# EAGLE design OpenModemV2_rx (EAGLE 9.6.0)

## Sheet 1 of 2
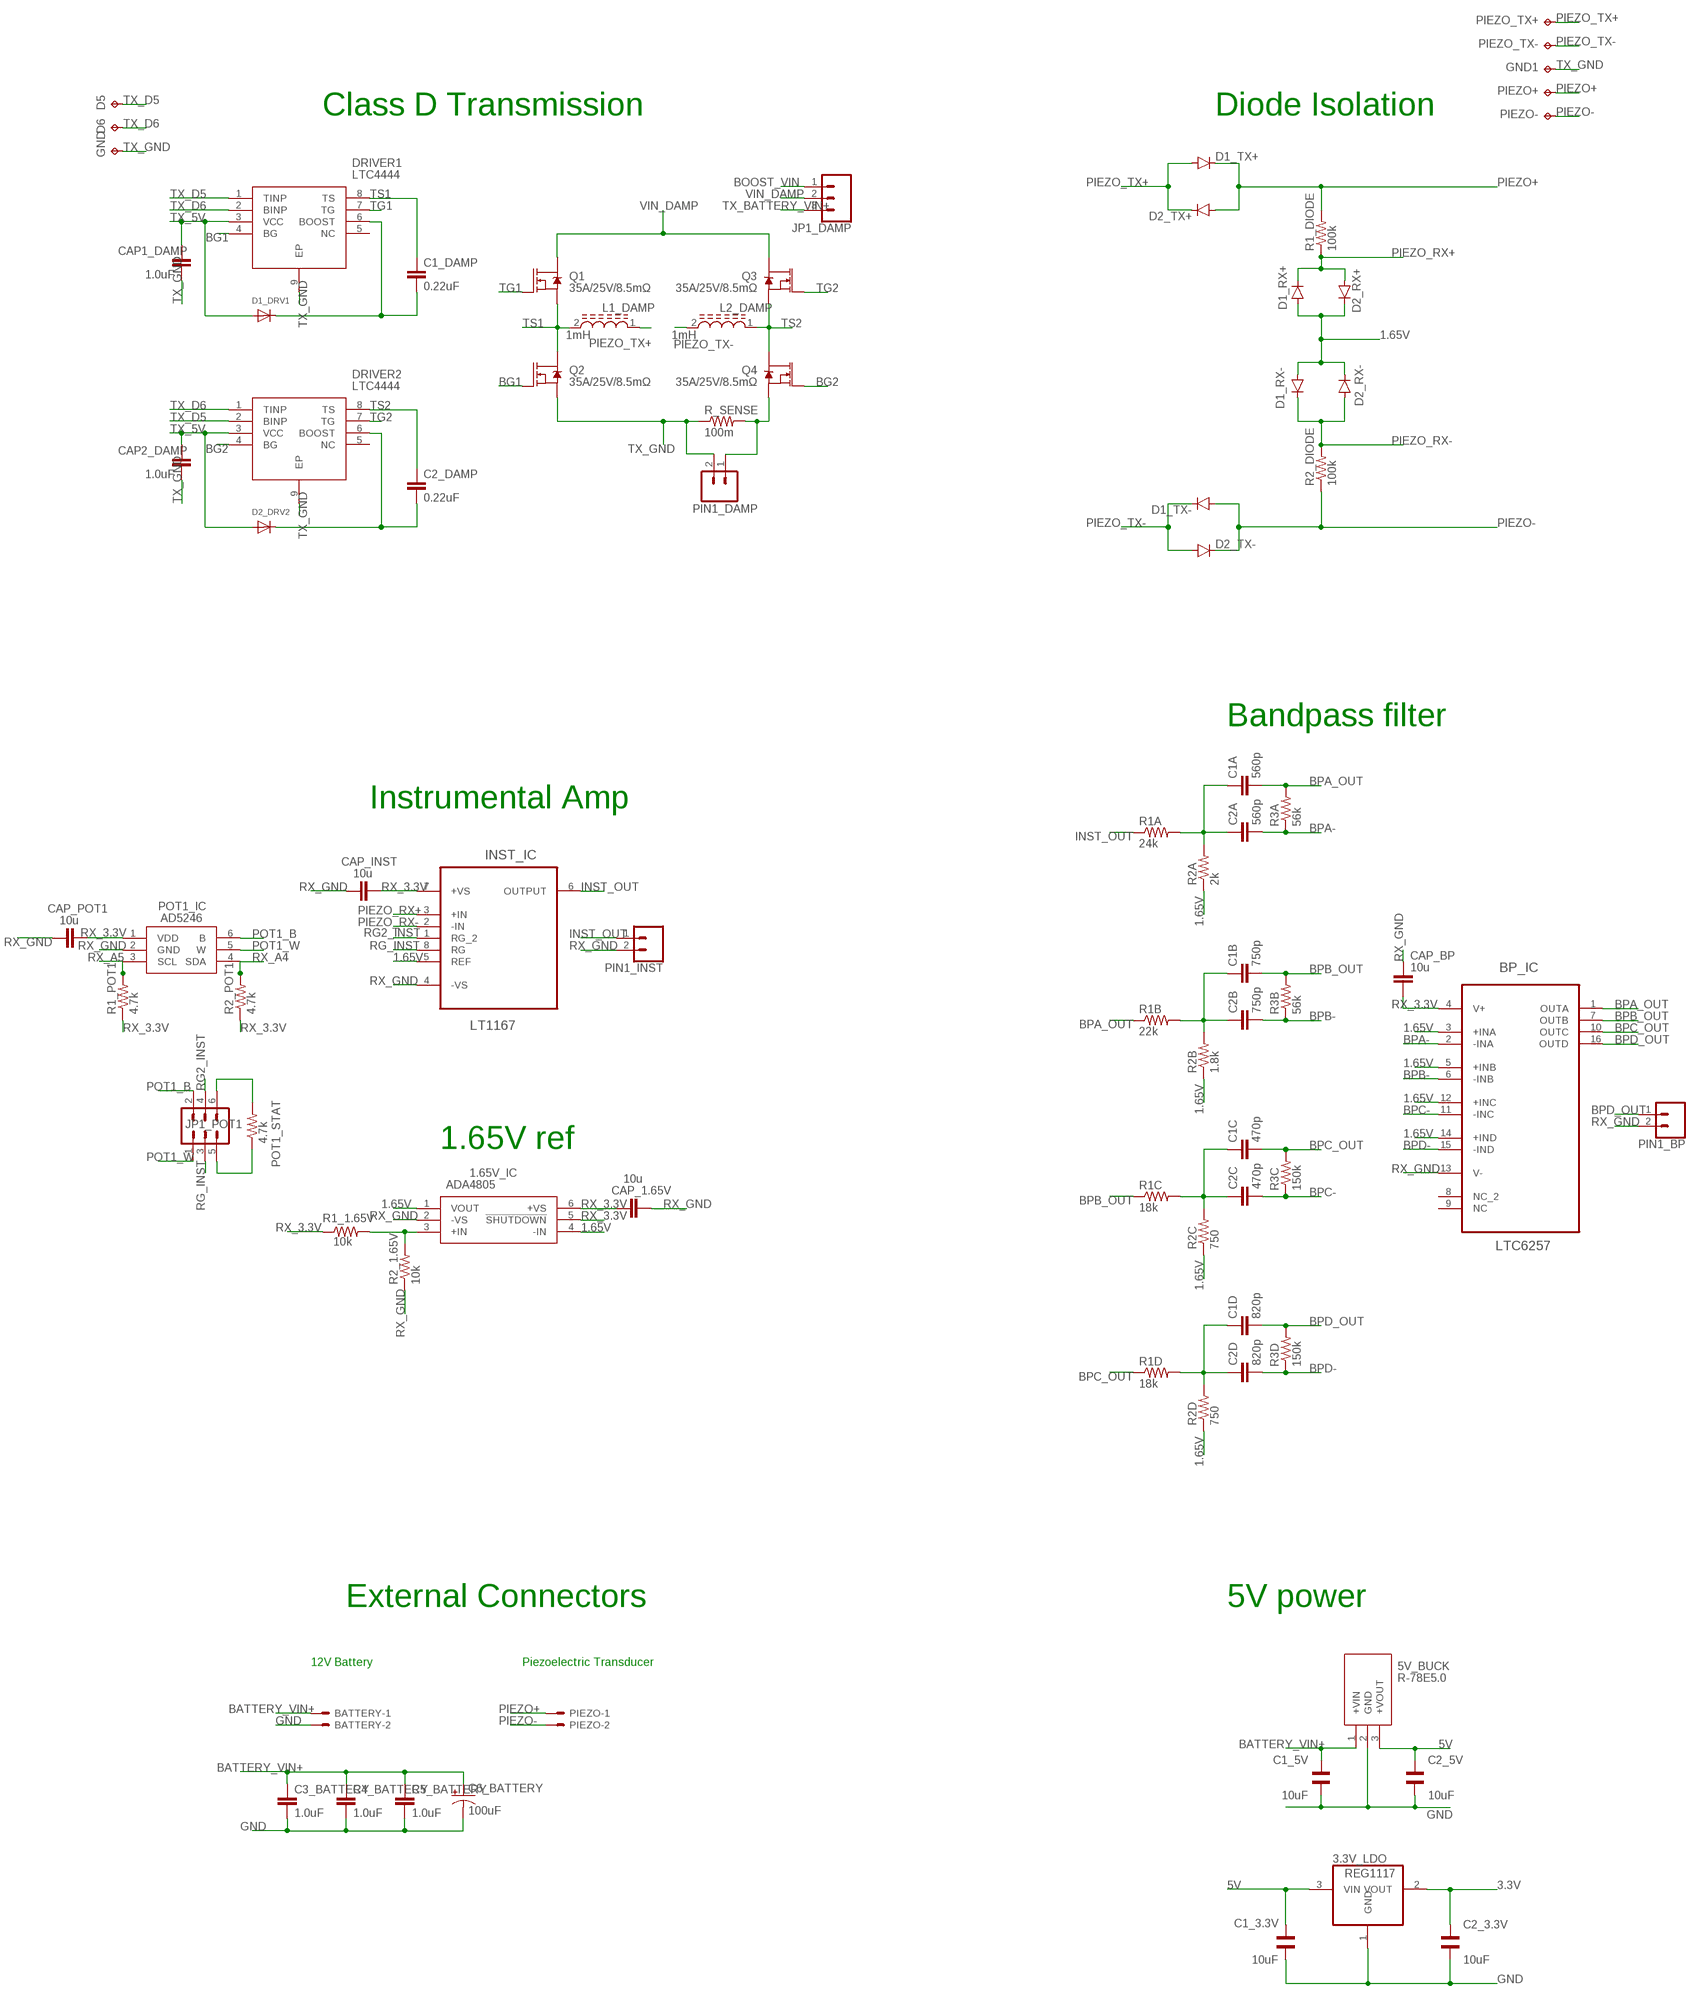
[diagram p0: schematic, sheet 1, part 1 of 2]
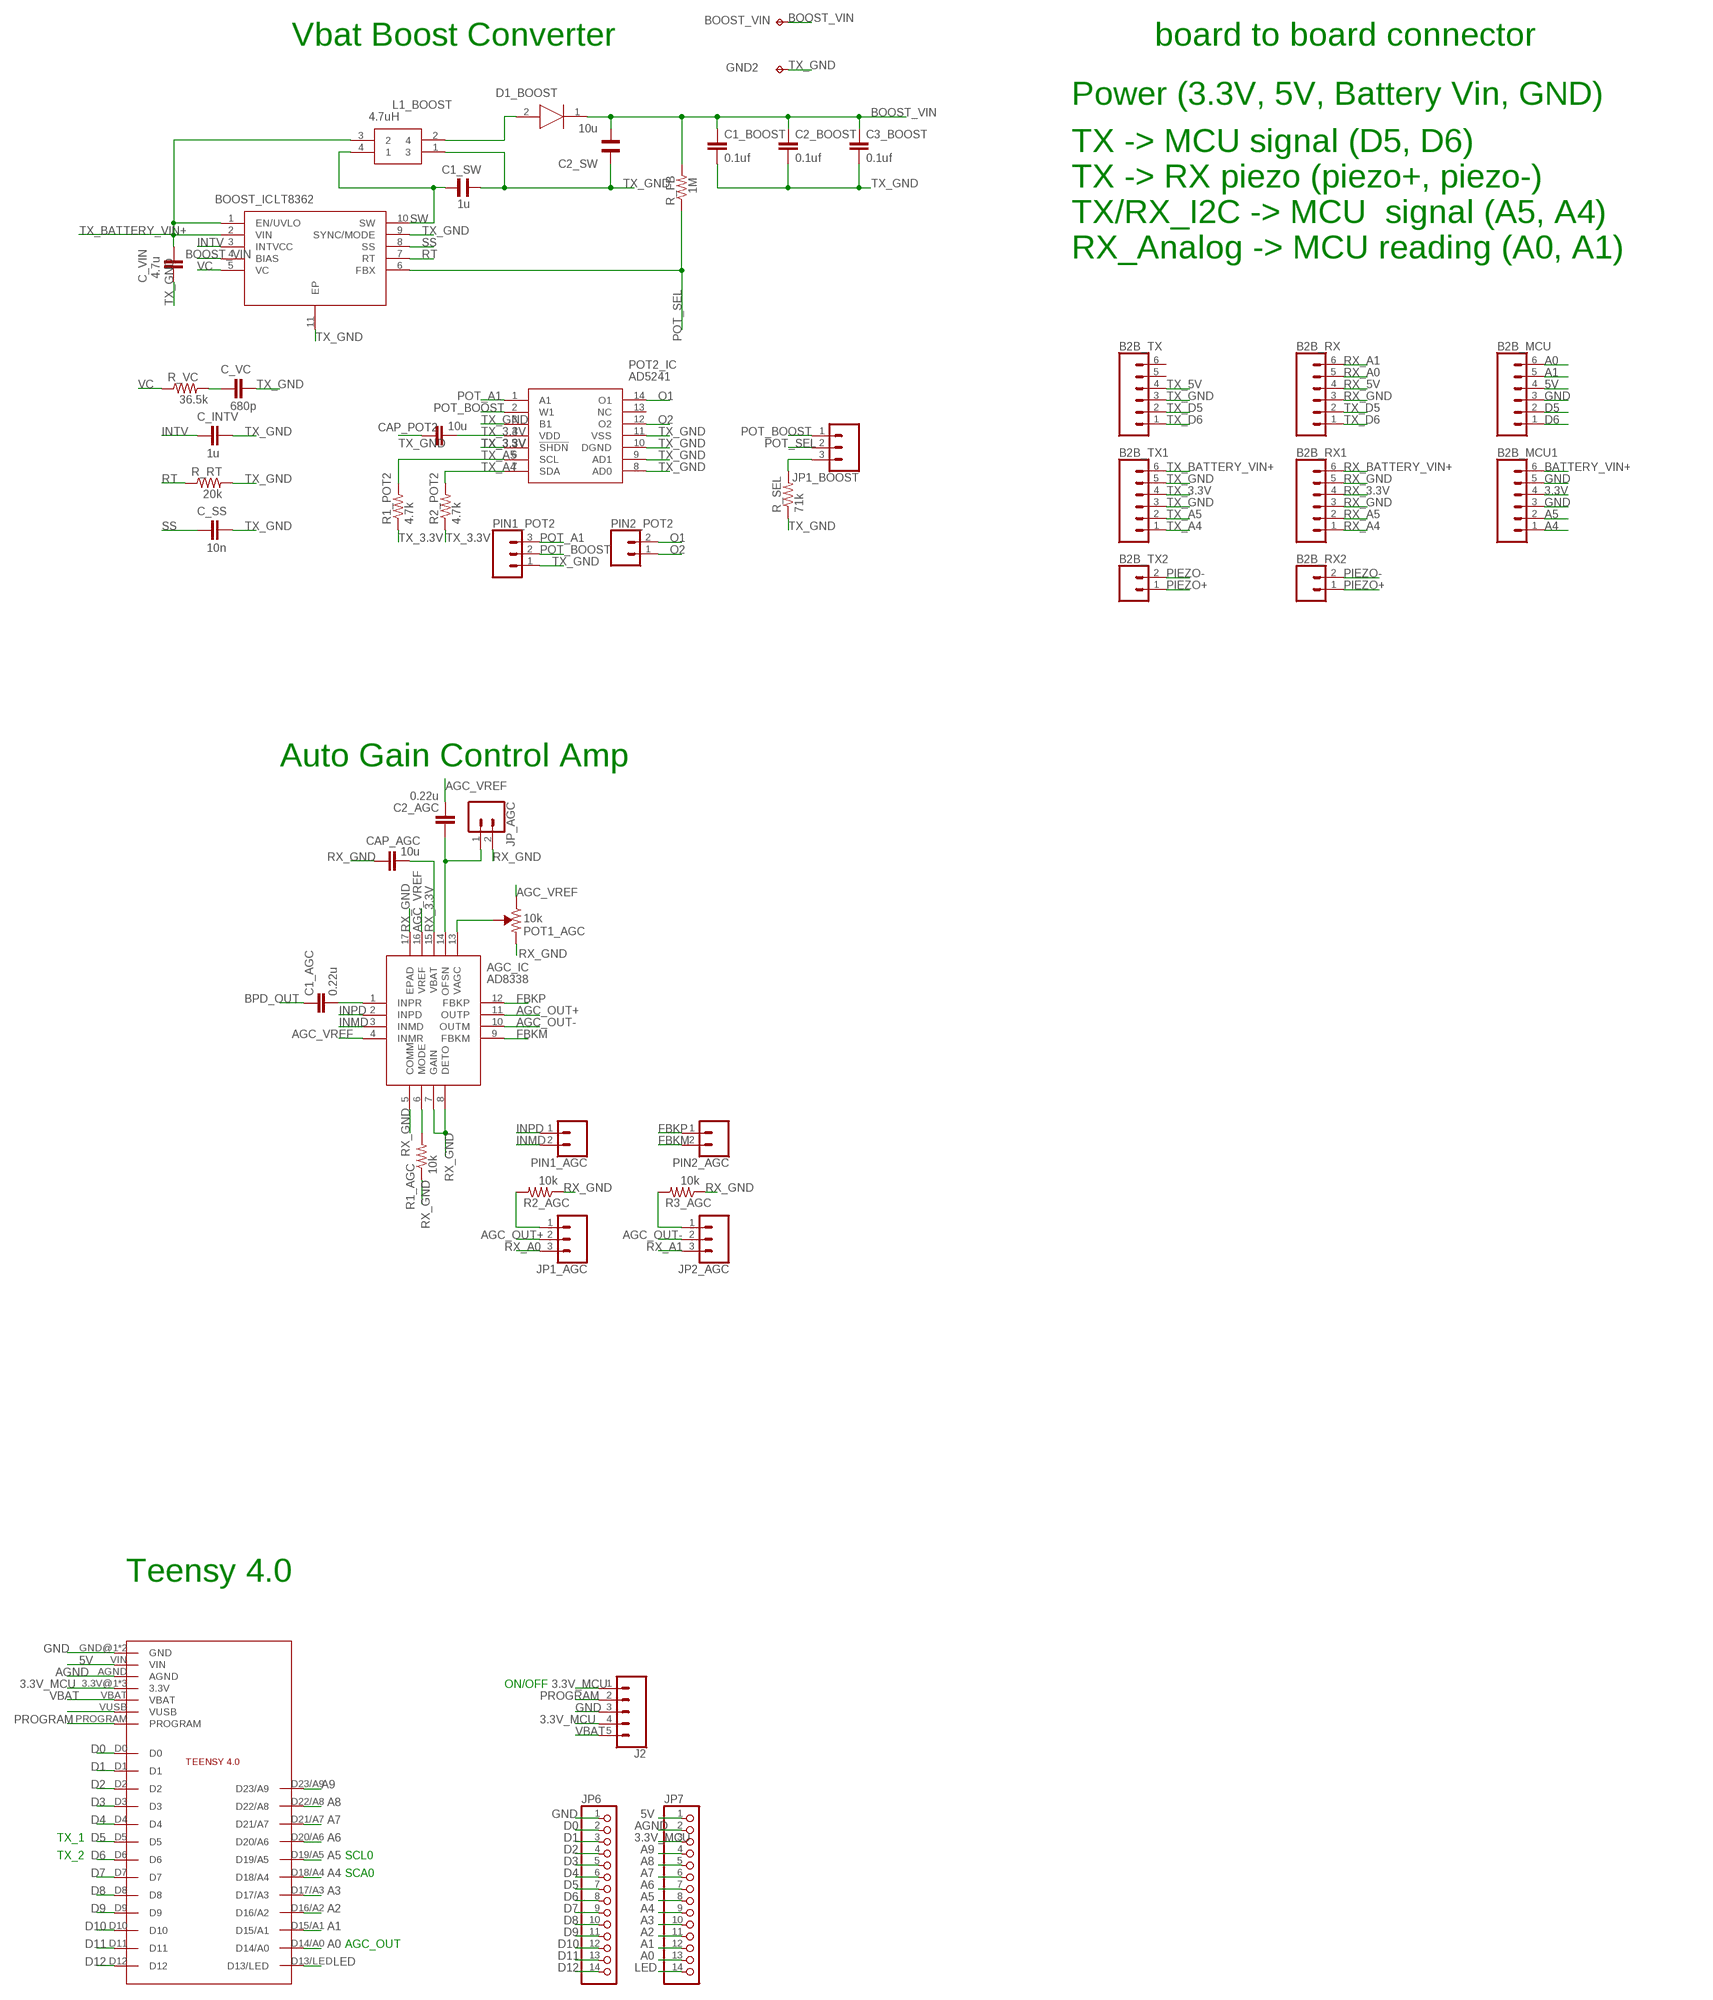
[diagram p1: schematic, sheet 1, part 2 of 2]

### Parts
1.65V_IC  ADA4805  ADA4805-1ARJZ-R7  [SOT95P280X145-6N]
3.3V_LDO  REG1117  [SOT223]
5V_BUCK  R-78E5.0  R-78E5.0-1.0  [R-78E5.0-1.0]
AGC_IC  AD8338  AD8338ACPZ-R7  [QFN50P300X300X80-17N]
B2B_MCU  CONN_06SILK_FEMALE_PTH  [1X06]
B2B_MCU1  CONN_06SILK_FEMALE_PTH  [1X06]
B2B_RX  CONN_06SILK_FEMALE_PTH  [1X06]
B2B_RX1  CONN_06SILK_FEMALE_PTH  [1X06]
B2B_RX2  CONN_02  [1X02]
B2B_TX  CONN_06SILK_FEMALE_PTH  [1X06]
B2B_TX1  CONN_06SILK_FEMALE_PTH  [1X06]
B2B_TX2  CONN_02  [1X02]
BATTERY  22-27-2021-02  [6410-02]
BOOST_IC  LT8362  LT8362EDD#PBF  [SON50P300X300X80-11N]
BOOST_VIN  TPPAD1-13  [P1-13]
BP_IC  LTC6257  LTC6257CMSPBF  [SOP50P490X110-16N]
C1_3.3V  10uF  WCAP-CSGP_0603_885012006001_REFLOW  [WCAP-CSGP_0603_REFLOW]
C1_5V  10uF  WCAP-CSGP_0603_885012006001_REFLOW  [WCAP-CSGP_0603_REFLOW]
C1_AGC  0.22u  CC0402  [C0402]
C1_BOOST  0.1uf  1.0UF-0805-25V-(+80/-20%)  [0805]
C1_DAMP  0.22uF  0.22UF-0603-25V-10%  [0603]
C1_SW  1u  WCAP-CSGP_1206_885012008001  [WCAP-CSGP_1206]
C1A  560p  CC0402  [C0402]
C1B  750p  CC0402  [C0402]
C1C  470p  CC0402  [C0402]
C1D  820p  CC0402  [C0402]
C2_3.3V  10uF  WCAP-CSGP_0603_885012006001_REFLOW  [WCAP-CSGP_0603_REFLOW]
C2_5V  10uF  WCAP-CSGP_0603_885012006001_REFLOW  [WCAP-CSGP_0603_REFLOW]
C2_AGC  0.22u  CC0402  [C0402]
C2_BOOST  0.1uf  1.0UF-0805-25V-(+80/-20%)  [0805]
C2_DAMP  0.22uF  0.22UF-0603-25V-10%  [0603]
C2_SW  10u  WCAP-CSGP_1206_885012008001  [WCAP-CSGP_1206]
C2A  560p  CC0402  [C0402]
C2B  750p  CC0402  [C0402]
C2C  470p  CC0402  [C0402]
C2D  820p  CC0402  [C0402]
C3_BATTERY  1.0uF  1.0UF-0805-25V-(+80/-20%)  [0805]
C3_BOOST  0.1uf  1.0UF-0805-25V-(+80/-20%)  [0805]
C4_BATTERY  1.0uF  1.0UF-0805-25V-(+80/-20%)  [0805]
C5_BATTERY  1.0uF  1.0UF-0805-25V-(+80/-20%)  [0805]
C6_BATTERY  100uF  100UF-POLAR-25V-20%(ELEC)  [PANASONIC_D]
C_INTV  1u  CC0402  [C0402]
C_SS  10n  CC0402  [C0402]
C_VC  680p  CC0402  [C0402]
C_VIN  4.7u  CC0402  [C0402]
CAP1_DAMP  1.0uF  1.0UF-0603-16V-10%  [0603]
CAP2_DAMP  1.0uF  1.0UF-0603-16V-10%  [0603]
CAP_1.65V  10u  CC0402  [C0402]
CAP_AGC  10u  CC0402  [C0402]
CAP_BP  10u  CC0402  [C0402]
CAP_INST  10u  CC0402  [C0402]
CAP_POT1  10u  CC0402  [C0402]
CAP_POT2  10u  CC0402  [C0402]
D1_BOOST  DFLS260-7  [POWERDI123]
D1_DRV1  DIODESOD-323F  [SOD-323F]
D1_RX+  DIODE-SOD523  [SOD523]
D1_RX-  DIODE-SOD523  [SOD523]
D1_TX+  DIODE-SOD523  [SOD523]
D1_TX-  DIODE-SOD523  [SOD523]
D2_DRV2  DIODESOD-323F  [SOD-323F]
D2_RX+  DIODE-SOD523  [SOD523]
D2_RX-  DIODE-SOD523  [SOD523]
D2_TX+  DIODE-SOD523  [SOD523]
D2_TX-  DIODE-SOD523  [SOD523]
D5  TPPAD1-13  [P1-13]
D6  TPPAD1-13  [P1-13]
DRIVER1  LTC4444  LTC4444IMS8E-5#PBF  [SOP65P490X110-9N]
DRIVER2  LTC4444  LTC4444IMS8E-5#PBF  [SOP65P490X110-9N]
GND  TPPAD1-13  [P1-13]
GND1  TPPAD1-13  [P1-13]
GND2  TPPAD1-13  [P1-13]
INST_IC  LT1167  LT1167AIS8PBF  [SOIC127P600X175-8N]
J2  CONN_05  [1X05]
JP1_AGC  CONN_03  [1X03]
JP1_BOOST  CONN_03  [1X03]
JP1_DAMP  CONN_03  [1X03]
JP1_POT1  CONN_03X2NO_SILK  [2X3-NS]
JP2_AGC  CONN_03  [1X03]
JP6  PINHD-1X14-CB  [1X14-CB]
JP7  PINHD-1X14-CB  [1X14-CB]
JP_AGC  CONN_02  [1X02]
L1_BOOST  4.7uH  744878004  [WE-DD_7332/734512]
L1_DAMP  1mH  SRR1260-102K  [INDP125125X600N]
L2_DAMP  1mH  SRR1260-102K  [INDP125125X600N]
PIEZO  22-27-2021-02  [6410-02]
PIEZO+  TPPAD1-13  [P1-13]
PIEZO-  TPPAD1-13  [P1-13]
PIEZO_TX+  TPPAD1-13  [P1-13]
PIEZO_TX-  TPPAD1-13  [P1-13]
PIN1_AGC  CONN_02  [1X02]
PIN1_BP  CONN_02  [1X02]
PIN1_DAMP  CONN_02  [1X02]
PIN1_INST  CONN_02  [1X02]
PIN1_POT2  CONN_03  [1X03]
PIN2_AGC  CONN_02  [1X02]
PIN2_POT2  CONN_02  [1X02]
POT1_AGC  10k  TRIMPOT-SMD-3MM-CLOSED-1/8W-20%  [TRIMPOT-SMD-3MM-CLOSED]
POT1_IC  AD5246  AD5246BKSZ100-RL7  [SOT65P210X110-6N]
POT1_STAT  4.7k  R-US_R0603  [R0603]
POT2_IC  AD5241  AD5241BRUZ10-R7  [SOP65P640X120-14N]
Q1  35A/25V/8.5mΩ  MOSFET-NCH-FDD8780  [DPAK]
Q2  35A/25V/8.5mΩ  MOSFET-NCH-FDD8780  [DPAK]
Q3  35A/25V/8.5mΩ  MOSFET-NCH-FDD8780  [DPAK]
Q4  35A/25V/8.5mΩ  MOSFET-NCH-FDD8780  [DPAK]
R1_1.65V  10k  R-US_R0603  [R0603]
R1_AGC  10k  R-US_R0603  [R0603]
R1_DIODE  100k  R-US_R0603  [R0603]
R1_POT1  4.7k  R-US_R0603  [R0603]
R1_POT2  4.7k  R-US_R0603  [R0603]
R1A  24k  R-US_R0603  [R0603]
R1B  22k  R-US_R0603  [R0603]
R1C  18k  R-US_R0603  [R0603]
R1D  18k  R-US_R0603  [R0603]
R2_1.65V  10k  R-US_R0603  [R0603]
R2_AGC  10k  R-US_R0603  [R0603]
R2_DIODE  100k  R-US_R0603  [R0603]
R2_POT1  4.7k  R-US_R0603  [R0603]
R2_POT2  4.7k  R-US_R0603  [R0603]
R2A  2k  R-US_R0603  [R0603]
R2B  1.8k  R-US_R0603  [R0603]
R2C  750  R-US_R0603  [R0603]
R2D  750  R-US_R0603  [R0603]
R3_AGC  10k  R-US_R0603  [R0603]
R3A  56k  R-US_R0603  [R0603]
R3B  56k  R-US_R0603  [R0603]
R3C  150k  R-US_R0603  [R0603]
R3D  150k  R-US_R0603  [R0603]
R_FB  1M  R-US_R0603  [R0603]
R_RT  20k  R-US_R0603  [R0603]
R_SEL  71k  R-US_R0603  [R0603]
R_SENSE  100m  R-US_M1206  [M1206]
R_VC  36.5k  R-US_R0603  [R0603]
U$1  TEENSY4.0  [TEENSY4.0]

### Nets
1.65V: 1.65V_IC.1(VOUT) 1.65V_IC.4(-IN) BP_IC.3(+INA) BP_IC.5(+INB) BP_IC.12(+INC) BP_IC.14(+IND) D1_RX+.A D1_RX-.A D2_RX+.C D2_RX-.C INST_IC.5(REF) R2A.1 R2B.1 R2C.1 R2D.1
3.3V: 3.3V_LDO.2(VOUT) B2B_MCU1.4 C2_3.3V.2
3.3V_MCU: J2.1 J2.4 JP7.3 U$1.3.3V@1(3.3V) U$1.3.3V@2(3.3V) U$1.ON/OFF(3.3V)
5V: 3.3V_LDO.3(VIN) 5V_BUCK.3(+VOUT) B2B_MCU.4 C1_3.3V.2 C2_5V.2 JP7.1 U$1.VIN
A0: B2B_MCU.6 JP7.13 U$1.D14/A0
A1: B2B_MCU.5 JP7.12 U$1.D15/A1
A2: JP7.11 U$1.D16/A2
A3: JP7.10 U$1.D17/A3
A4: B2B_MCU1.1 JP7.9 U$1.D18/A4
A5: B2B_MCU1.2 JP7.8 U$1.D19/A5
A6: JP7.7 U$1.D20/A6
A7: JP7.6 U$1.D21/A7
A8: JP7.5 U$1.D22/A8
A9: JP7.4 U$1.D23/A9
AGC_OUT+: AGC_IC.11(OUTP) JP1_AGC.2
AGC_OUT-: AGC_IC.10(OUTM) JP2_AGC.2
AGC_VREF: AGC_IC.4(INMR) AGC_IC.16(VREF) C2_AGC.2 POT1_AGC.3(CW)
AGND: JP7.2 U$1.AGND
BATTERY_VIN+: 5V_BUCK.1(+VIN) B2B_MCU1.6 BATTERY.1 C1_5V.1 C3_BATTERY.1 C4_BATTERY.1 C5_BATTERY.1 C6_BATTERY.+
BG1: DRIVER1.4(BG) Q2.1(G)
BG2: DRIVER2.4(BG) Q4.1(G)
BOOST_VIN: BOOST_IC.4(BIAS) BOOST_VIN.TP C1_BOOST.1 C2_BOOST.1 C2_SW.1 C3_BOOST.1 D1_BOOST.1(K) JP1_DAMP.1 R_FB.2
BPA-: BP_IC.2(-INA) C2A.2 R3A.1
BPA_OUT: BP_IC.1(OUTA) C1A.2 R1B.1 R3A.2
BPB-: BP_IC.6(-INB) C2B.2 R3B.1
BPB_OUT: BP_IC.7(OUTB) C1B.2 R1C.1 R3B.2
BPC-: BP_IC.11(-INC) C2C.2 R3C.1
BPC_OUT: BP_IC.10(OUTC) C1C.2 R1D.1 R3C.2
BPD-: BP_IC.15(-IND) C2D.2 R3D.1
BPD_OUT: BP_IC.16(OUTD) C1_AGC.1 C1D.2 PIN1_BP.1 R3D.2
D0: JP6.2 U$1.D0
D1: JP6.3 U$1.D1
D2: JP6.4 U$1.D2
D3: JP6.5 U$1.D3
D4: JP6.6 U$1.D4
D5: B2B_MCU.2 JP6.7 U$1.D5
D6: B2B_MCU.1 JP6.8 U$1.D6
D7: JP6.9 U$1.D7
D8: JP6.10 U$1.D8
D9: JP6.11 U$1.D9
D10: JP6.12 U$1.D10
D11: JP6.13 U$1.D11
D12: JP6.14 U$1.D12
FBKM: AGC_IC.9(FBKM) PIN2_AGC.2
FBKP: AGC_IC.12(FBKP) PIN2_AGC.1
GND: 3.3V_LDO.1(GND) 5V_BUCK.2(GND) B2B_MCU1.3 B2B_MCU1.5 B2B_MCU.3 BATTERY.2 C1_3.3V.1 C1_5V.2 C2_3.3V.1 C2_5V.1 C3_BATTERY.2 C4_BATTERY.2 C5_BATTERY.2 C6_BATTERY.- J2.3 JP6.1 U$1.GND@1(GND) U$1.GND@2(GND)
INMD: AGC_IC.3(INMD) PIN1_AGC.2
INPD: AGC_IC.2(INPD) PIN1_AGC.1
INST_OUT: INST_IC.6(OUTPUT) PIN1_INST.1 R1A.1
INTV: BOOST_IC.3(INTVCC) C_INTV.2
LED: JP7.14 U$1.D13/LED
N$1: U$1.VUSB
N$2: C1_DAMP.2 D1_DRV1.C DRIVER1.6(BOOST)
N$3: C2_DAMP.2 D2_DRV2.C DRIVER2.6(BOOST)
N$4: JP1_POT1.6 POT1_STAT.2
N$7: C1A.1 C2A.1 R1A.2 R2A.2
N$8: C1B.1 C2B.1 R1B.2 R2B.2
N$9: C1C.1 C2C.1 R1C.2 R2C.2
N$10: C1D.1 C2D.1 R1D.2 R2D.2
N$11: C_VC.2 R_VC.2
N$12: AGC_IC.6(MODE) R1_AGC.2
N$13: 1.65V_IC.3(+IN) R1_1.65V.2 R2_1.65V.2
N$14: AGC_IC.1(INPR) C1_AGC.2
N$15: JP1_POT1.5 POT1_STAT.1
N$17: JP1_AGC.1 R2_AGC.2
N$18: JP2_AGC.1 R3_AGC.2
N$19: AGC_IC.14(OFSN) C2_AGC.1 JP_AGC.1
N$20: AGC_IC.13(VAGC) POT1_AGC.2(WIPER)
N$21: PIN1_DAMP.1 Q4.3(S) R_SENSE.2
N$22: D1_BOOST.2(A) L1_BOOST.2
N$23: JP1_BOOST.3 R_SEL.2
O1: PIN2_POT2.2 POT2_IC.14(O1)
O2: PIN2_POT2.1 POT2_IC.12(O2)
PIEZO+: B2B_RX2.1 B2B_TX2.1 D1_TX+.C D2_TX+.A PIEZO+.TP PIEZO.1 R1_DIODE.2
PIEZO-: B2B_RX2.2 B2B_TX2.2 D1_TX-.A D2_TX-.C PIEZO-.TP PIEZO.2 R2_DIODE.1
PIEZO_RX+: D1_RX+.C D2_RX+.A INST_IC.3(+IN) R1_DIODE.1
PIEZO_RX-: D1_RX-.C D2_RX-.A INST_IC.2(-IN) R2_DIODE.2
PIEZO_TX+: D1_TX+.A D2_TX+.C L1_DAMP.1 PIEZO_TX+.TP
PIEZO_TX-: D1_TX-.C D2_TX-.A L2_DAMP.2 PIEZO_TX-.TP
POT1_B: JP1_POT1.2 POT1_IC.6(B)
POT1_W: JP1_POT1.1 POT1_IC.5(W)
POT_A1: PIN1_POT2.3 POT2_IC.1(A1)
POT_BOOST: JP1_BOOST.1 PIN1_POT2.2 POT2_IC.2(W1)
POT_SEL: BOOST_IC.6(FBX) JP1_BOOST.2 R_FB.1
PROGRAM: J2.2 U$1.PROGRAM
RG2_INST: INST_IC.1(RG_2) JP1_POT1.4
RG_INST: INST_IC.8(RG) JP1_POT1.3
RT: BOOST_IC.7(RT) R_RT.1
RX_3.3V: 1.65V_IC.5(!SHUTDOWN) 1.65V_IC.6(+VS) AGC_IC.15(VBAT) B2B_RX1.4 BP_IC.4(V+) CAP_1.65V.2 CAP_AGC.1 CAP_BP.1 CAP_INST.2 CAP_POT1.2 INST_IC.7(+VS) POT1_IC.1(VDD) R1_1.65V.1 R1_POT1.1 R2_POT1.1
RX_5V: B2B_RX.4
RX_A0: B2B_RX.5 JP1_AGC.3
RX_A1: B2B_RX.6 JP2_AGC.3
RX_A4: B2B_RX1.1 POT1_IC.4(SDA) R2_POT1.2
RX_A5: B2B_RX1.2 POT1_IC.3(SCL) R1_POT1.2
RX_BATTERY_VIN+: B2B_RX1.6
RX_GND: 1.65V_IC.2(-VS) AGC_IC.5(COMM) AGC_IC.7(GAIN) AGC_IC.8(DETO) AGC_IC.17(EPAD) B2B_RX1.3 B2B_RX1.5 B2B_RX.3 BP_IC.13(V-) CAP_1.65V.1 CAP_AGC.2 CAP_BP.2 CAP_INST.1 CAP_POT1.1 INST_IC.4(-VS) JP_AGC.2 PIN1_BP.2 PIN1_INST.2 POT1_AGC.1(CCW) POT1_IC.2(GND) R1_AGC.1 R2_1.65V.1 R2_AGC.1 R3_AGC.1
SS: BOOST_IC.8(SS) C_SS.2
SW: BOOST_IC.10(SW) C1_SW.2 L1_BOOST.4
TG1: DRIVER1.7(TG) Q1.1(G)
TG2: DRIVER2.7(TG) Q3.1(G)
TS1: C1_DAMP.1 DRIVER1.8(TS) L1_DAMP.2 Q1.3(S) Q2.4(D)
TS2: C2_DAMP.1 DRIVER2.8(TS) L2_DAMP.1 Q3.3(S) Q4.4(D)
TX_3.3V: B2B_TX1.4 CAP_POT2.1 POT2_IC.4(VDD) POT2_IC.5(!SHDN) R1_POT2.1 R2_POT2.1
TX_5V: B2B_TX.4 CAP1_DAMP.1 CAP2_DAMP.1 D1_DRV1.A D2_DRV2.A DRIVER1.3(VCC) DRIVER2.3(VCC)
TX_A4: B2B_TX1.1 POT2_IC.7(SDA) R2_POT2.2
TX_A5: B2B_TX1.2 POT2_IC.6(SCL) R1_POT2.2
TX_BATTERY_VIN+: B2B_TX1.6 BOOST_IC.1(EN/UVLO) BOOST_IC.2(VIN) C_VIN.2 JP1_DAMP.3 L1_BOOST.3
TX_D5: B2B_RX.2 B2B_TX.2 D5.TP DRIVER1.1(TINP) DRIVER2.2(BINP)
TX_D6: B2B_RX.1 B2B_TX.1 D6.TP DRIVER1.2(BINP) DRIVER2.1(TINP)
TX_GND: B2B_TX1.3 B2B_TX1.5 B2B_TX.3 BOOST_IC.9(SYNC/MODE) BOOST_IC.11(EP) C1_BOOST.2 C1_SW.1 C2_BOOST.2 C2_SW.2 C3_BOOST.2 C_INTV.1 C_SS.1 C_VC.1 C_VIN.1 CAP1_DAMP.2 CAP2_DAMP.2 CAP_POT2.2 DRIVER1.9(EP) DRIVER2.9(EP) GND1.TP GND2.TP GND.TP L1_BOOST.1 PIN1_DAMP.2 PIN1_POT2.1 POT2_IC.3(B1) POT2_IC.8(AD0) POT2_IC.9(AD1) POT2_IC.10(DGND) POT2_IC.11(VSS) Q2.3(S) R_RT.2 R_SEL.1 R_SENSE.1
VBAT: J2.5 U$1.VBAT
VC: BOOST_IC.5(VC) R_VC.1
VIN_DAMP: JP1_DAMP.2 Q1.4(D) Q3.4(D)
Unconnected: B2B_TX.5 B2B_TX.6 BP_IC.8(NC_2) BP_IC.9(NC) DRIVER1.5(NC) DRIVER2.5(NC) POT2_IC.13(NC)

### Notes on the sheet
- Vbat Boost Converter | board to board connector
- Class D Transmission | Diode Isolation
- Power (3.3V, 5V, Battery Vin, GND)
- TX -> MCU signal (D5, D6)
  TX -> RX piezo (piezo+, piezo-)
  TX/RX_I2C -> MCU  signal (A5, A4)
  RX_Analog -> MCU reading (A0, A1)
- Bandpass filter
- Auto Gain Control Amp
- Instrumental Amp
- 1.65V ref
- External Connectors | 5V power | Teensy 4.0
- 12V Battery | Piezoelectric Transducer
- ON/OFF
- TX_1
- TX_2 | SCL0
- SCA0
- AGC_OUT

## Sheet 2 of 2

## Library data of the parts
1.65V_IC = SamacSys_Parts:ADA4805-1ARJZ-R7: ANALOG DEVICES - ADA4805-1ARJZ-R7 - IC OP-AMP 105MHZ, SOT23 Source: Datasheet <https://componentsearchengine.com/Datasheets/1/ADA4805-1ARJZ-R7.pdf>; DESCRIPTION: ANALOG DEVICES - ADA4805-1ARJZ-R7 - IC OP-AMP 105MHZ, SOT23; HEIGHT: 1.45mm; MANUFACTURER_NAME: Analog Devices; MANUFACTURER_PART_NUMBER: ADA4805-1ARJZ-R7; MOUSER_PART_NUMBER: 584-ADA4805-1ARJZ-R7; MOUSER_PRICE-STOCK: https://www.mouser.com/Search/Refine.aspx?Keyword=584-ADA4805-1ARJZ-R7
3.3V_LDO = burr-brown:REG1117: 800mA and 1A Low Dropout (LDO) Positive Regulator 1.8V, 2.5V, 2.85V, 3.3V, 5V, and Adj; MPN: REG1117; OC_FARNELL: 1097566; OC_NEWARK: 14P6981
5V_BUCK = SamacSys_Parts:R-78E5.0-1.0: Non-Isolated DC/DC Converters 8-28Vin 5V 1.0A THRU Source: Datasheet <https://componentsearchengine.com/Datasheets/1/R-78E5.0-1.0.pdf>; DESCRIPTION: Non-Isolated DC/DC Converters 8-28Vin 5V 1.0A THRU; HEIGHT: mm; MANUFACTURER_NAME: RECOM Power; MANUFACTURER_PART_NUMBER: R-78E5.0-1.0; MOUSER_PART_NUMBER: 919-R-78E5.0-1.0; MOUSER_PRICE-STOCK: https://www.mouser.com/Search/Refine.aspx?Keyword=919-R-78E5.0-1.0
AGC_IC = SamacSys_Parts:AD8338ACPZ-R7: Analog Devices AD8338ACPZ-R7, Variable Gain Amplifier 200mV Offset, R-RO 3 5 V 16-Pin LFCSP Source: Datasheet <https://componentsearchengine.com/Datasheets/1/AD8338ACPZ-R7.pdf>; DESCRIPTION: Analog Devices AD8338ACPZ-R7, Variable Gain Amplifier 200mV Offset, R-RO 3 5 V 16-Pin LFCSP; HEIGHT: 0.8mm; MANUFACTURER_NAME: Analog Devices; MANUFACTURER_PART_NUMBER: AD8338ACPZ-R7; MOUSER_PART_NUMBER: 584-AD8338ACPZ-R7; MOUSER_PRICE-STOCK: https://www.mouser.com/Search/Refine.aspx?Keyword=584-AD8338ACPZ-R7
B2B_MCU B2B_MCU1 B2B_RX B2B_RX1 B2B_TX B2B_TX1 = SparkFun-Connectors:CONN_06: Multi connection point. Often used as Generic Header-pin footprint for 0.1 inch spaced/style header connections On any of the 0.1 inch spaced packages, you can populate with these: Break Away Headers - Straight <https://www.sparkfun.com/products/116> (PRT-00116) Break Away Male Headers - Right Angle <https://www.sparkfun.com/products/553> (PRT-00553) Female Headers <https://www.sparkfun.com/products/115> (PRT-00115) Break Away Headers - Machine Pin <https://www.sparkfun.com/products/117> (PRT-00117) Break Away Female Headers - Swiss Machine Pin <https://www.sparkfun.com/products/743> (PRT-00743) Arduino Stackable Header - 6 Pin <https://www.sparkfun.com/products/9280> (PRT-09280) For SCREWTERMINALS and SPRING TERMINALS visit here: Screw Terimnals on SparkFun.com <https://www.sparkfun.com/search/results?term=Screw+Terminals> (5mm/3.5mm/2.54mm spacing) This device is also useful as a general connection point to wire up your design to another part of your project. Our various solder wires solder well into these plated through hole pads. Hook-Up Wire - Assortment (Stranded, 22 AWG) <https://www.sparkfun.com/products/11375> (PRT-11375) Hook-Up Wire - Assortment (Solid Core, 22 AWG) <https://www.sparkfun.com/products/11367> (PRT-11367) View the entire wire category on our website here <https://www.sparkfun.com/categories/141>; PROD_ID: CONN-08437
B2B_RX2 B2B_TX2 JP_AGC PIN1_AGC PIN1_BP PIN1_DAMP PIN1_INST PIN2_AGC PIN2_POT2 = SparkFun-Connectors:CONN_02: Multi connection point. Often used as Generic Header-pin footprint for 0.1 inch spaced/style header connections On any of the 0.1 inch spaced packages, you can populate with these: Break Away Headers - Straight <https://www.sparkfun.com/products/116> (PRT-00116) Break Away Male Headers - Right Angle <https://www.sparkfun.com/products/553> (PRT-00553) Female Headers <https://www.sparkfun.com/products/115> (PRT-00115) Break Away Headers - Machine Pin <https://www.sparkfun.com/products/117> (PRT-00117) Break Away Female Headers - Swiss Machine Pin <https://www.sparkfun.com/products/743> (PRT-00743) For SCREWTERMINALS and SPRING TERMINALS visit here: Screw Terimnals on SparkFun.com <https://www.sparkfun.com/search/results?term=Screw+Terminals> (5mm/3.5mm/2.54mm spacing) This device is also useful as a general connection point to wire up your design to another part of your project. Our various solder wires solder well into these plated through hole pads. Hook-Up Wire - Assortment (Stranded, 22 AWG) <https://www.sparkfun.com/products/11375> (PRT-11375) Hook-Up Wire - Assortment (Solid Core, 22 AWG) <https://www.sparkfun.com/products/11367> (PRT-11367) View the entire wire category on our website here <https://www.sparkfun.com/categories/141> Special notes: Molex polarized connector foot print use with: PRT-08233 with associated crimp pins and housings. 2.54_SCREWTERM for use with PRT-10571. 3.5mm Screw Terminal footprints for PRT-08084 5mm Screw Terminal footprints for use with PRT-08432
BATTERY PIEZO = con-molex:22-?-02: CONNECTOR wire to board 2.54 mm (.1 inch) pitch header; MF: MOLEX; OC_FARNELL: unknown; OC_NEWARK: unknown
BOOST_IC = SamacSys_Parts:LT8362EDD#PBF: Boost, SEPIC Switching Regulator IC Positive Fixed 1 Output 2A (Switch) 10-WFDFN Exposed Pad Source: Datasheet <https://componentsearchengine.com/Datasheets/1/LT8362EDD#PBF.pdf>; DESCRIPTION: Boost, SEPIC Switching Regulator IC Positive Fixed 1 Output 2A (Switch) 10-WFDFN Exposed Pad; HEIGHT: 0.8mm; MANUFACTURER_NAME: Linear Technology; MANUFACTURER_PART_NUMBER: LT8362EDD#PBF; MOUSER_PART_NUMBER: 584-LT8362EDDPBF; MOUSER_PRICE-STOCK: https://www.mouser.com/Search/Refine.aspx?Keyword=584-LT8362EDDPBF
BOOST_VIN D5 D6 GND GND1 GND2 PIEZO+ PIEZO- PIEZO_TX+ PIEZO_TX- = testpad:TP: Test pad
BP_IC = LTC_By_element14_Batch_1:LTC6257CMSPBF: 6.5MHz, 65ìA PowerEffi cient Rail-to-Rail I/OOp Amps; MPN: LTC6257CMS#PBF; OC_FARNELL: 1832985; OC_NEWARK: 78R8399; PACKAGE: MSOP-16; SUPPLIER: Linear Technology
C1_3.3V C1_5V C2_3.3V C2_5V = Wurth_Elektronik_Passive_Capacitors_rev18b:WCAP-CSGP_0603: WCAP-CSGP Ceramic Capacitors Characteristics Multilayer Ceramic Chip Capacitor Recommended soldering:Reflow, for 0603 and 0805 wave soldering is also allowed Operating temperature:-55 °C to +125 °C; Ceramic characteristics: Class I - NPO ; Class II -X7R, X5R High performance ceramic High capacitance stability Minimal aging Termination:Cu/Ni/Sn <http://katalog.we-online.de/media/images/eisos/WCAP-CSGP_pf2.jpg> Details see: http://katalog.we-online.de/en/pbs/WCAP-CSGP-0603? Created: 2015-01-28 2015 (C) Wurth Elektronik
C1_AGC C1A C1B C1C C1D C2_AGC C2A C2B C2C C2D C_INTV C_SS C_VC C_VIN CAP_1.65V CAP_AGC CAP_BP CAP_INST CAP_POT1 CAP_POT2 = eagle-ltspice:C: CAPACITOR, European symbol; SPICEMODEL: NONE; SPICEPREFIX: C
C1_BOOST C2_BOOST C3_BOOST = SparkFun-Capacitors:1.0UF: 1µF ceramic capacitors A capacitor is a passive two-terminal electrical component used to store electrical energy temporarily in an electric field.; PROD_ID: CAP-11625; VALUE: 1.0uF
C1_DAMP C2_DAMP = SparkFun-Capacitors:0.22UF: 0.22µF ceramic capacitors A capacitor is a passive two-terminal electrical component used to store electrical energy temporarily in an electric field.; PROD_ID: CAP-07822
C1_SW C2_SW = Wurth_Elektronik_Passive_Capacitors_rev18b:WCAP-CSGP_1206: WCAP-CSGP Ceramic Capacitors Characteristics Multilayer Ceramic Chip Capacitor Recommended soldering:Reflow, for 0603 and 0805 wave soldering is also allowed Operating temperature:-55 °C to +125 °C; Ceramic characteristics: Class I - NPO ; Class II -X7R, X5R High performance ceramic High capacitance stability Minimal aging Termination:Cu/Ni/Sn <http://katalog.we-online.de/media/images/eisos/WCAP-CSGP_pf2.jpg> Details see: http://katalog.we-online.de/en/pbs/WCAP-CSGP-1206? Created: 2015-01-28 2015 (C) Wurth Elektronik
C3_BATTERY C4_BATTERY C5_BATTERY = SparkFun-Capacitors:1.0UF: 1µF ceramic capacitors A capacitor is a passive two-terminal electrical component used to store electrical energy temporarily in an electric field.; PROD_ID: CAP-11625
C6_BATTERY = SparkFun-Capacitors:100UF-POLAR: 100µF polarized capacitors A capacitor is a passive two-terminal electrical component used to store electrical energy temporarily in an electric field.; PROD_ID: CAP-12547
CAP1_DAMP CAP2_DAMP = SparkFun-Capacitors:1.0UF: 1µF ceramic capacitors A capacitor is a passive two-terminal electrical component used to store electrical energy temporarily in an electric field.; PROD_ID: CAP-00868
D1_BOOST = SamacSys_Parts:DFLS260-7: 2A 60V Schottky Rectifier PowerDI123 Diodes Inc DFLS260-7, SMT Schottky Diode, 60V 2A, 2-Pin PowerDI 123 Source: Datasheet <https://componentsearchengine.com/Datasheets/1/DFLS260-7.pdf>; DESCRIPTION: 2A 60V Schottky Rectifier PowerDI123 Diodes Inc DFLS260-7, SMT Schottky Diode, 60V 2A, 2-Pin PowerDI 123; HEIGHT: mm; MANUFACTURER_NAME: Diodes Inc.; MANUFACTURER_PART_NUMBER: DFLS260-7; MOUSER_PART_NUMBER: 621-DFLS260-7; MOUSER_PRICE-STOCK: https://www.mouser.com/Search/Refine.aspx?Keyword=621-DFLS260-7
D1_DRV1 D2_DRV2 = adafruit:DIODE: Diode SMADIODE - SMA Surface Mount Package 20V 1A Schottky Diode Digikey: 641-1014-6-ND DO-1N4148 - Through Hole Small Current Diode SOD-123 20V 1 A (.5mV Vf) Schottky Diode - Digikey: MBRX120TPMSCT-ND SOD-323 10V 570mA (.38mV Vf, 3ns) Schottky Diode - Digikey: ZLLS410CT-ND SOD-523 30V 30mA Schottky Diode (RB751S-40TE61) - Digikey: RB751S-40TE61CT-ND SOT23-R/W - SOT23 Package (R = Solder Paste/Reflow Ovens, W = Hand-Soldering) BAT54Film 40V 300mA - Digikey: 497-7162-1-ND
D1_RX+ D1_RX- D1_TX+ D1_TX- D2_RX+ D2_RX- D2_TX+ D2_TX- = diode:DIODE-: DIODE
DRIVER1 DRIVER2 = SamacSys_Parts:LTC4444IMS8E-5#PBF: LTC4444 - High Voltage Synchronous N-Channel MOSFET Driver Source: Datasheet <https://componentsearchengine.com/Datasheets/1/LTC4444IMS8E-5#PBF.pdf>; DESCRIPTION: LTC4444 - High Voltage Synchronous N-Channel MOSFET Driver; HEIGHT: 1.1mm; MANUFACTURER_NAME: Linear Technology; MANUFACTURER_PART_NUMBER: LTC4444IMS8E-5#PBF; MOUSER_PART_NUMBER: 584-C4444IMS8E-5PBF; MOUSER_PRICE-STOCK: https://www.mouser.com/Search/Refine.aspx?Keyword=584-C4444IMS8E-5PBF
INST_IC = LTC_By_element14_Batch_1:LT1167AIS8PBF: Single Resistor Gain Programmable, Precision Instrumentation Amplifier; MPN: LT1167AIS8#PBF; OC_FARNELL: 1663385; OC_NEWARK: 57M2299; PACKAGE: SOIC-8; SUPPLIER: Linear Technology
J2 = SparkFun-Connectors:CONN_05: Multi connection point. Often used as Generic Header-pin footprint for 0.1 inch spaced/style header connections On any of the 0.1 inch spaced packages, you can populate with these: Break Away Headers - Straight <https://www.sparkfun.com/products/116> (PRT-00116) Break Away Male Headers - Right Angle <https://www.sparkfun.com/products/553> (PRT-00553) Female Headers <https://www.sparkfun.com/products/115> (PRT-00115) Break Away Headers - Machine Pin <https://www.sparkfun.com/products/117> (PRT-00117) Break Away Female Headers - Swiss Machine Pin <https://www.sparkfun.com/products/743> (PRT-00743) For SCREWTERMINALS and SPRING TERMINALS visit here: Screw Terimnals on SparkFun.com <https://www.sparkfun.com/search/results?term=Screw+Terminals> (5mm/3.5mm/2.54mm spacing) This device is also useful as a general connection point to wire up your design to another part of your project. Our various solder wires solder well into these plated through hole pads. Hook-Up Wire - Assortment (Stranded, 22 AWG) <https://www.sparkfun.com/products/11375> (PRT-11375) Hook-Up Wire - Assortment (Solid Core, 22 AWG) <https://www.sparkfun.com/products/11367> (PRT-11367) View the entire wire category on our website here <https://www.sparkfun.com/categories/141> Special notes: Molex polarized connector foot print use with SKU : PRT-08231 with associated crimp pins and housings. 1MM SMD Version SKU: PRT-10208
JP1_AGC JP1_BOOST JP1_DAMP JP2_AGC PIN1_POT2 = SparkFun-Connectors:CONN_03: Multi connection point. Often used as Generic Header-pin footprint for 0.1 inch spaced/style header connections On any of the 0.1 inch spaced packages, you can populate with these: Break Away Headers - Straight <https://www.sparkfun.com/products/116> (PRT-00116) Break Away Male Headers - Right Angle <https://www.sparkfun.com/products/553> (PRT-00553) Female Headers <https://www.sparkfun.com/products/115> (PRT-00115) Break Away Headers - Machine Pin <https://www.sparkfun.com/products/117> (PRT-00117) Break Away Female Headers - Swiss Machine Pin <https://www.sparkfun.com/products/743> (PRT-00743) Stackable Header - 3 Pin (Female, 0.1") <https://www.sparkfun.com/products/13875> (PRT-13875) For SCREWTERMINALS and SPRING TERMINALS visit here: Screw Terimnals on SparkFun.com <https://www.sparkfun.com/search/results?term=Screw+Terminals> (5mm/3.5mm/2.54mm spacing) This device is also useful as a general connection point to wire up your design to another part of your project. Our various solder wires solder well into these plated through hole pads. Hook-Up Wire - Assortment (Stranded, 22 AWG) <https://www.sparkfun.com/products/11375> (PRT-11375) Hook-Up Wire - Assortment (Solid Core, 22 AWG) <https://www.sparkfun.com/products/11367> (PRT-11367) View the entire wire category on our website here <https://www.sparkfun.com/categories/141> Special notes: Molex polarized connector foot print use with SKU : PRT-08232 with associated crimp pins and housings.
JP1_POT1 = SparkFun-Connectors:CONN_03X2: Multi connection point. Often used as Generic Header-pin footprint for 0.1 inch spaced/style header connections You can populate with any combo of single row headers, but if you'd like an exact match, check these: Header - 2x3 (Male, 0.1") <https://www.sparkfun.com/products/12807> (PRT-12807) Header - 2x3 (Female, 0.1") <https://www.sparkfun.com/products/13010> (PRT-13010) 2x3 Pin Shrouded Header <https://www.sparkfun.com/products/10877> (PRT-10877) On any of the 0.1 inch spaced packages, you can populate with these: Break Away Headers - Straight <https://www.sparkfun.com/products/116> (PRT-00116) Break Away Male Headers - Right Angle <https://www.sparkfun.com/products/553> (PRT-00553) Female Headers <https://www.sparkfun.com/products/115> (PRT-00115) Break Away Headers - Machine Pin <https://www.sparkfun.com/products/117> (PRT-00117) Break Away Female Headers - Swiss Machine Pin <https://www.sparkfun.com/products/743> (PRT-00743) Special note: the shrouded connector mates well with our 3x2 ribbon cables: Ribbon Crimp Connector - 6-pin (2x3, Female) <https://www.sparkfun.com/products/10651> (PRT-10651) Ribbon Cable - 6 wire (15ft) <https://www.sparkfun.com/products/10646> (PRT-10646)
JP6 JP7 = adafruit:PINHD-1X14: PIN HEADER
L1_BOOST = SamacSys_Parts:744878004: Wurth WE-DD Series Shielded Wire-wound SMD Inductor with a Ferrite Core, 4.7 uH +/-20% Coupled 3A Idc Source: Datasheet <https://componentsearchengine.com/Datasheets/1/744878004.pdf>; DESCRIPTION: Wurth WE-DD Series Shielded Wire-wound SMD Inductor with a Ferrite Core, 4.7 uH +/-20% Coupled 3A Idc; HEIGHT: mm; MANUFACTURER_NAME: Wurth Elektronik; MANUFACTURER_PART_NUMBER: 744878004; MOUSER_PART_NUMBER: 710-744878004; MOUSER_PRICE-STOCK: https://www.mouser.com/Search/Refine.aspx?Keyword=710-744878004
L1_DAMP L2_DAMP = SRR1260-102K:SRR1260-102K: Inductor Power Shielded Wirewound 33uH 20% 100KHz 27Q-Factor Ferrite 3A 60mOhm DCR T/R; DESCRIPTION: 1mH Shielded Wirewound Inductor 680mA 1.7Ohm Max Nonstandard; DIGI-KEY_PART_NUMBER: SRR1260-102KCT-ND; DIGI-KEY_PURCHASE_URL: https://www.digikey.com/product-detail/en/bourns-inc/SRR1260-102K/SRR1260-102KCT-ND/2127404?utm_source=snapeda&utm_medium=aggregator&utm_campaign=symbol; MF: Bourns; MP: SRR1260-102K; PACKAGE: Nonstandard Bourns
POT1_AGC = SparkFun-Resistors:TRIMPOT: Trimming Potentiometer (Trimpot) Three-terminal potentiometers, with an adjustable wiper and two adjustable resistors. A pot can be used to create a configurable voltage divider, or as a variable resistor. "Trimpots" are a subset of potentiometers, usually intended for "set-and-forget" applications. They're often more delicate than standard potentiometers - rated for fewer turns. Variants PTH-KNOB - PTH Trimpot w/ finger-adjustable knob Trimpot 10K with Knob <https://www.sparkfun.com/products/9806> (COM-09806) Datasheet <http://www.sparkfun.com/datasheets/Components/General/TSR-3386.pdf> SMD-3MM-CLOSED-FRAME - SMD 3mm Square Closed-Frame Trimpot Used on e.g. EasyDriver - Stepper Motor Driver <https://www.sparkfun.com/products/12779> Datasheet <http://www.bitechnologies.com/pdfs/22.pdf> (22AR10KTR) SMD-5MM - SMD 5mm Square Closed-Frame Trimpot Used on e.g. IOIO-OTG - V2.2 <https://www.sparkfun.com/products/13613> Datasheet <http://www.vishay.com/docs/51008/ts53.pdf> (TS53YL502MR10) SMD-3MM-1/10W-25% - 3mm Square Open-Frame Trimpot Used on e.g. SparkFun Shapeoko <https://www.sparkfun.com/products/13899> Datasheet <http://www.bourns.com/docs/Product-Datasheets/TC33.pdf> (TC33X-2-103E); PROD_ID: RES-09285
POT1_IC = SamacSys_Parts:AD5246BKSZ100-RL7: ANALOG DEVICES - AD5246BKSZ100-RL7 - DIGITAL POT, VOLATILE, 100 KOHM, SC-70-6 Source: Datasheet <https://componentsearchengine.com/Datasheets/1/AD5246BKSZ100-RL7.pdf>; DESCRIPTION: ANALOG DEVICES - AD5246BKSZ100-RL7 - DIGITAL POT, VOLATILE, 100 KOHM, SC-70-6; HEIGHT: 1.1mm; MANUFACTURER_NAME: Analog Devices; MANUFACTURER_PART_NUMBER: AD5246BKSZ100-RL7; MOUSER_PART_NUMBER: 584-AD5246BKSZ100-R7; MOUSER_PRICE-STOCK: https://www.mouser.com/Search/Refine.aspx?Keyword=584-AD5246BKSZ100-R7
POT1_STAT R1_1.65V R1_AGC R1_DIODE R1_POT1 R1_POT2 R1A R1B R1C R1D R2_1.65V R2_AGC R2_DIODE R2_POT1 R2_POT2 R2A R2B R2C R2D R3_AGC R3A R3B R3C R3D R_FB R_RT R_SEL R_VC = audio amplifier example:R-US_: RESISTOR, American symbol
POT2_IC = SamacSys_Parts:AD5241BRUZ10-R7: Digital Potentiometer ICs IC I2C Compat Source: Datasheet <https://componentsearchengine.com/Datasheets/1/AD5241BRUZ10-R7.pdf>; DESCRIPTION: Digital Potentiometer ICs IC I2C Compat; HEIGHT: 1.2mm; MANUFACTURER_NAME: Analog Devices; MANUFACTURER_PART_NUMBER: AD5241BRUZ10-R7; MOUSER_PART_NUMBER: 584-AD5241BRUZ10-R7; MOUSER_PRICE-STOCK: https://www.mouser.com/Search/Refine.aspx?Keyword=584-AD5241BRUZ10-R7
Q1-Q4 = SparkFun-DiscreteSemi:MOSFET-NCH: N-channel MOSFETs Voltage controlled devices that allow control of high current outputs. SparkFun Products: SparkFun OpenScale <https://www.sparkfun.com/products/13261> SparkFun Digital Sandbox <https://www.sparkfun.com/products/12651> SparkFun Monster Moto Shield <https://www.sparkfun.com/products/10182> SparkFun MOSFET Power Controller <https://www.sparkfun.com/products/11214>; PROD_ID: TRANS-09984
R_SENSE = adafruit:R-US_: RESISTOR, American symbol
U$1 = Teensy4.0:TEENSY4.0

## Board
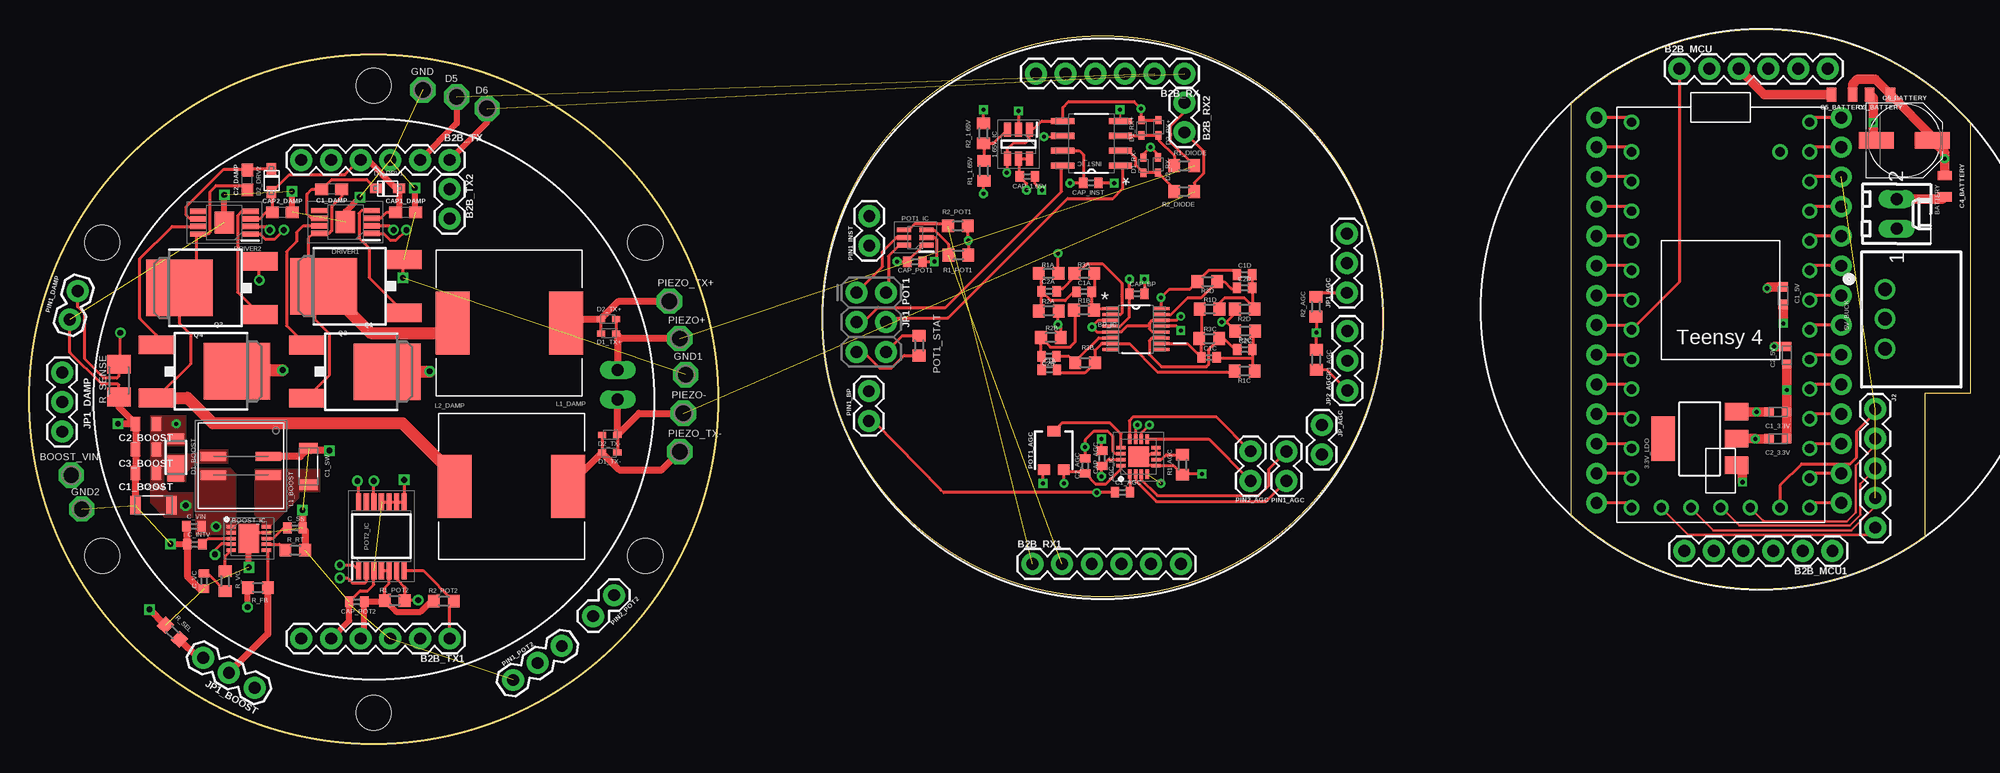
[diagram p2: board, top side]
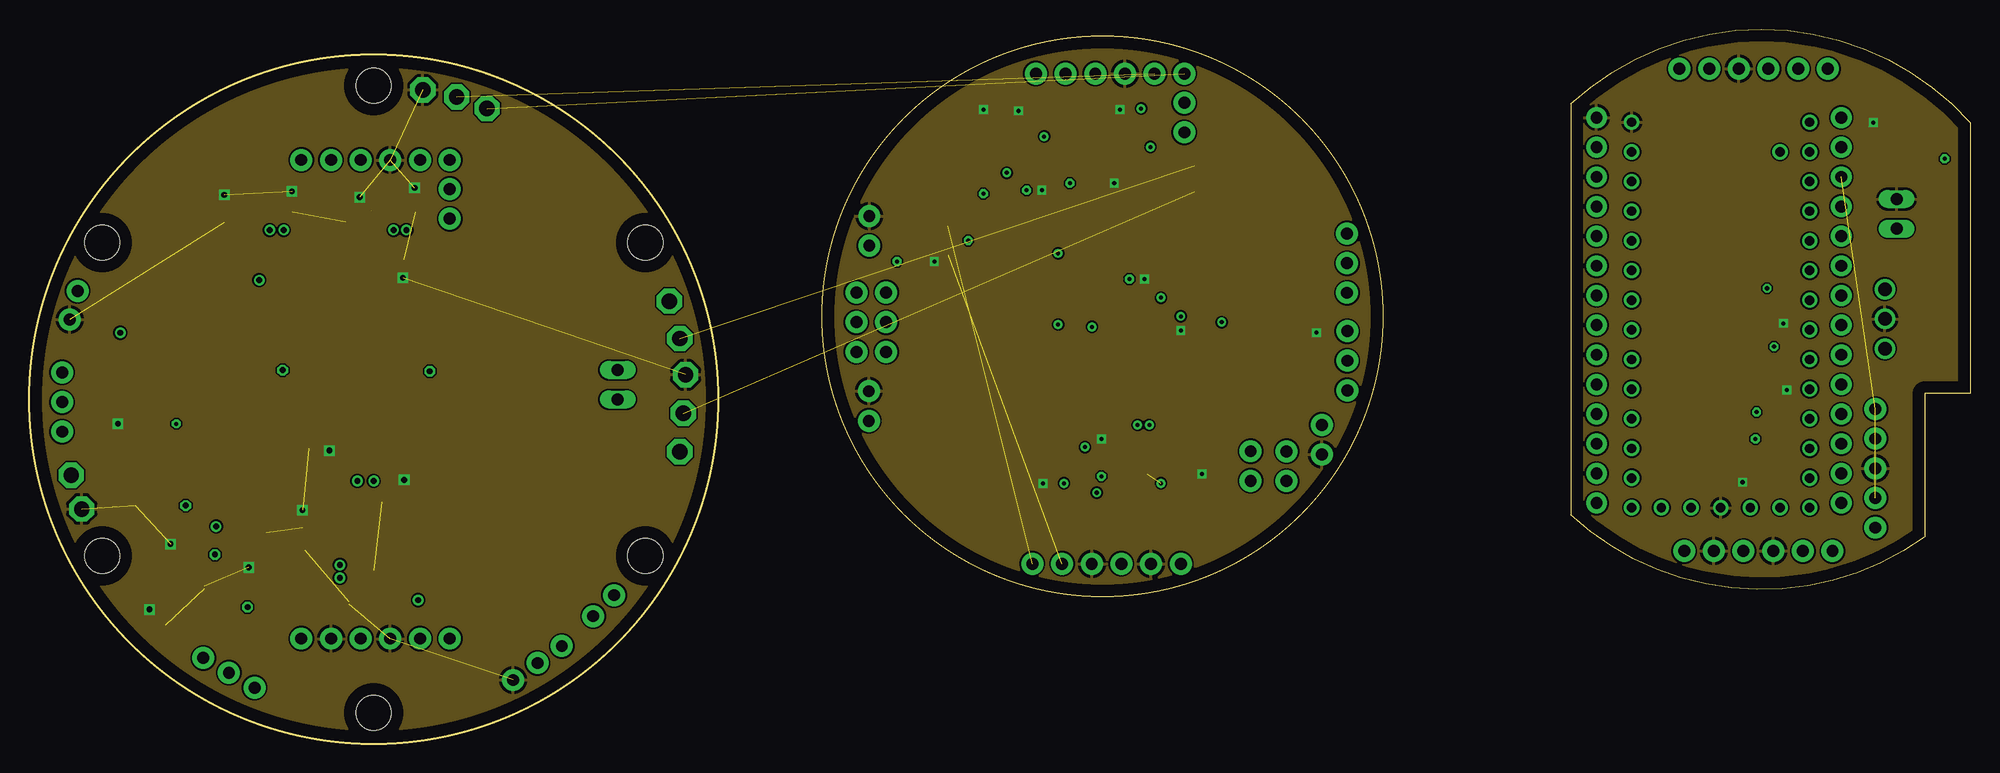
[diagram p3: board, inner layer GND]
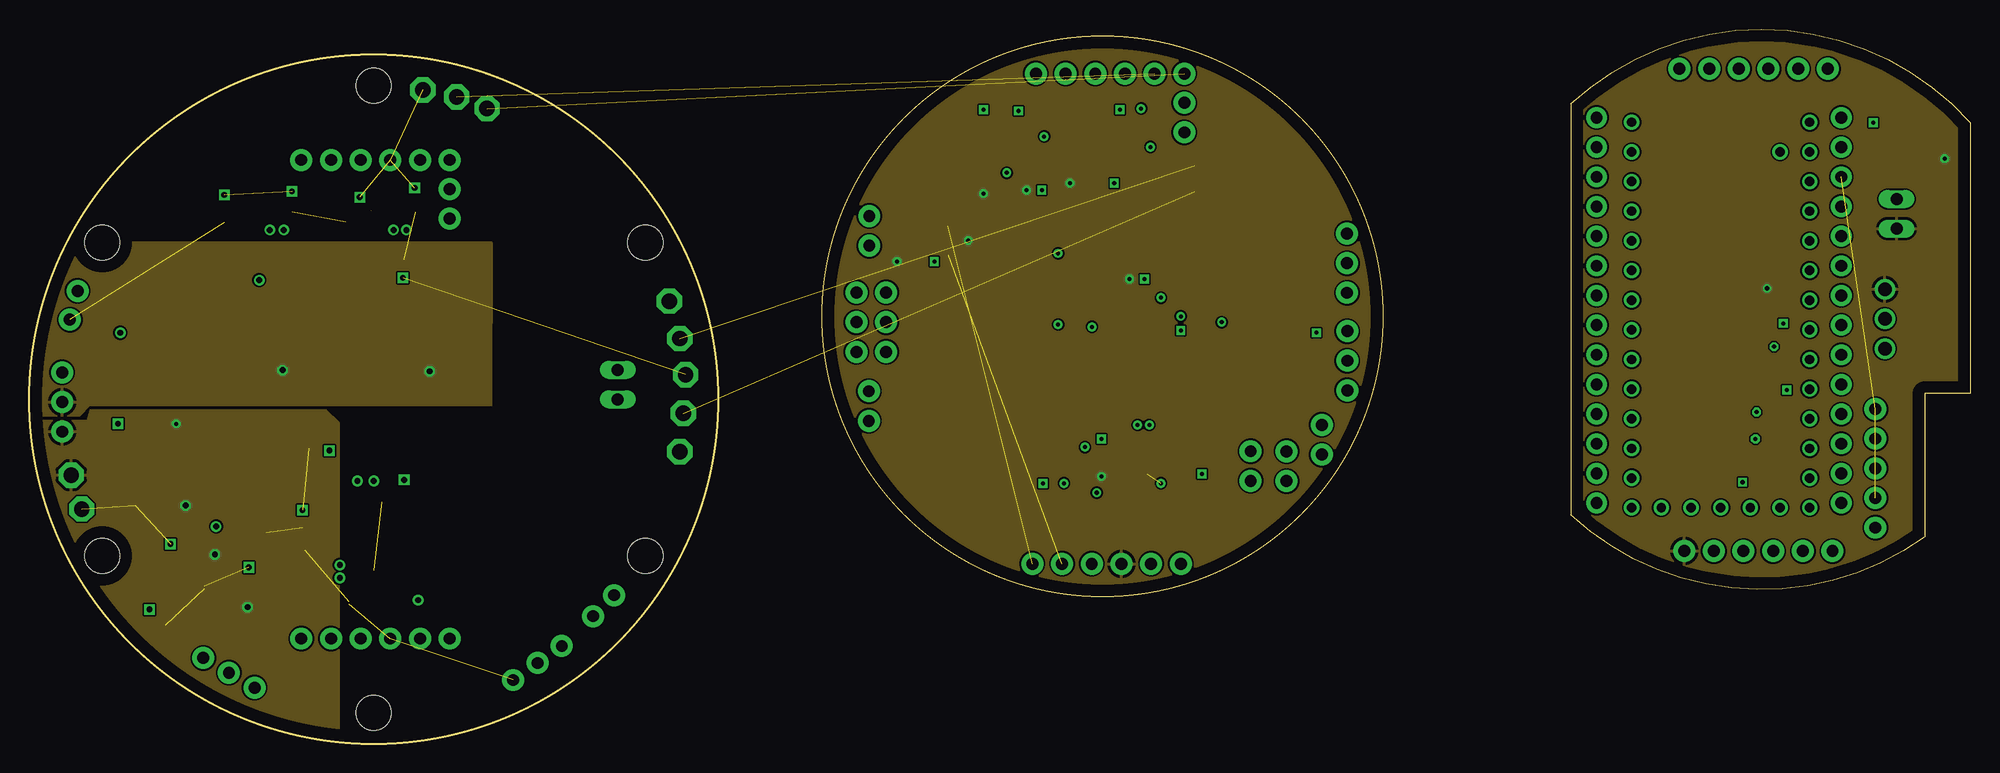
[diagram p4: board, inner layer POWER]
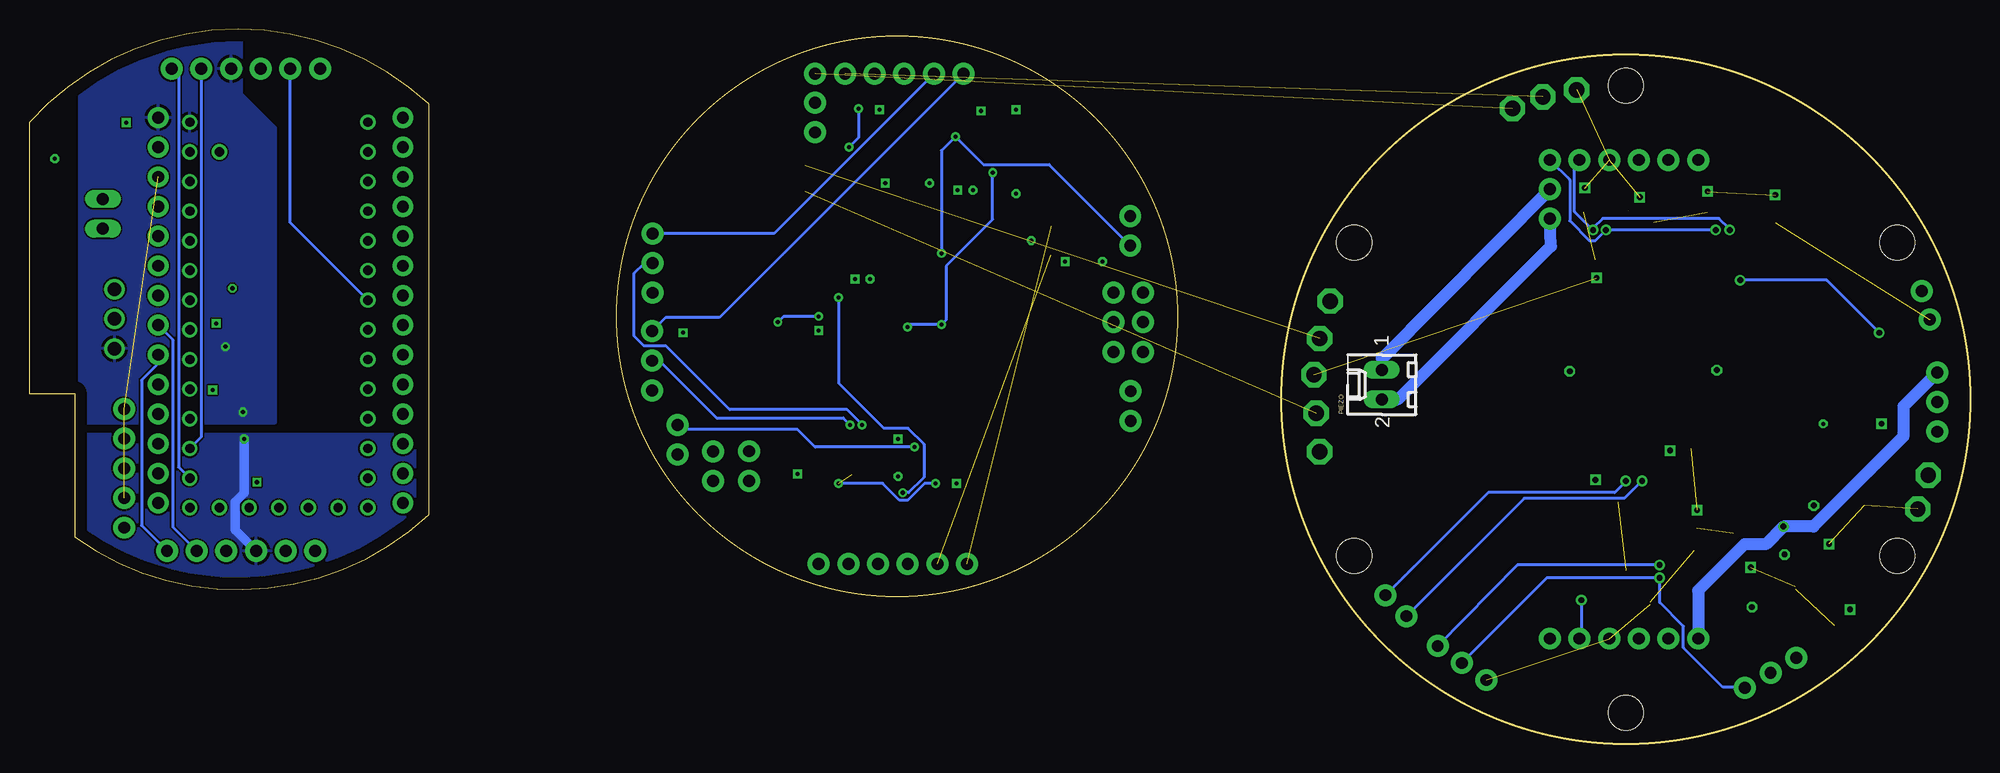
[diagram p5: board, bottom side, seen from below]

Size 166.2 x 61.2 mm. Coordinates in mm from the lower left corner, seen from the top.
Outline: 166.2,53.2 166.2,30 162.3,30 162.3,17.7 arc-78 132,19.6 132,54.8 arc-91 166.2,53.2
Outline: circle at 29.5,29.5 radius 29.5
Outline: circle at 91.9,36.6 radius 24
Copper layers (1+2*15+16): Top 0.035mm / dielectric 1.5mm / GND 0.035mm / dielectric 0.15mm / POWER 0.035mm / dielectric 0.2mm / Bottom 0.035mm
Design rules "default *": minimum track width 6mil, minimum drill 0.35mm, track to track 6mil, track to pad 6mil, pad to pad 6mil, via to via 6mil, smd to smd 6mil, copper to edge 40mil, drill to drill 6mil, minimum pad ring 10mil, minimum via ring 8mil, stop-mask expansion 4mil, vias tented up to drill 0mil, thermal gap 10mil
Holes 3 mm at 29.5,56.35 29.5,2.65 6.25,42.92 52.75,42.92 52.75,16.07 6.25,16.07

### Footprints (pad centres in the part's own frame; a part is rotated, then mirrored left to right if it is on the bottom)
SOT95P280X145-6N = smd 1.2 x 0.6: 1 -1.25,0.95; 2 -1.25,0; 3 -1.25,-0.95; 4 1.25,-0.95; 5 1.25,0; 6 1.25,0.95
SOT223 = smd 1.499 x 2.007: 1 -2.261,-3.15; 2 0.025,-3.15; 3 2.311,-3.15 | smd 3.81 x 2.007: 4 0,3.15
R-78E5.0-1.0 = drill 1.15 pad 1.75: 1 3.21,2; 2 5.75,2; 3 8.29,2
QFN50P300X300X80-17N = smd 0.8 x 0.3: 1 -1.5,0.75; 2 -1.5,0.25; 3 -1.5,-0.25; 4 -1.5,-0.75; 9 1.5,-0.75; 10 1.5,-0.25; 11 1.5,0.25; 12 1.5,0.75 | smd 0.3 x 0.8: 5 -0.75,-1.5; 6 -0.25,-1.5; 7 0.25,-1.5; 8 0.75,-1.5; 13 0.75,1.5; 14 0.25,1.5; 15 -0.25,1.5; 16 -0.75,1.5 | smd 1.75 x 1.75: 17 0,0
1X06 = drill 1.016 pad 1.88: 1 0,0; 2 2.54,0; 3 5.08,0; 4 7.62,0; 5 10.16,0; 6 12.7,0
1X02 = drill 1.016 pad 1.88: 1 0,0; 2 2.54,0
6410-02 = drill 1.016 long: 1 1.27,0; 2 -1.27,0
SON50P300X300X80-11N = smd 0.8 x 0.3: 1 -1.5,1; 2 -1.5,0.5; 3 -1.5,0; 4 -1.5,-0.5; 5 -1.5,-1; 6 1.5,-1; 7 1.5,-0.5; 8 1.5,0; 9 1.5,0.5; 10 1.5,1 | smd 1.75 x 2.48: 11 0,0
P1-13 = drill 1.321 pad 2.159 octagon: TP 0,0
SOP50P490X110-16N = smd 1.397 x 0.279: 1 -2.184,1.753; 2 -2.184,1.245; 3 -2.184,0.762; 4 -2.184,0.254; 5 -2.184,-0.254; 6 -2.184,-0.762; 7 -2.184,-1.245; 8 -2.184,-1.753; 9 2.184,-1.753; 10 2.184,-1.245; 11 2.184,-0.762; 12 2.184,-0.254; 13 2.184,0.254; 14 2.184,0.762; 15 2.184,1.245; 16 2.184,1.753
WCAP-CSGP_0603_REFLOW = smd 0.8 x 0.8: 1 -0.75,0; 2 0.75,0
C0402 = smd 0.7 x 0.9: 1 -0.65,0; 2 0.65,0
0805 = smd 0.8 x 1.2: 1 -0.9,0; 2 0.9,0
0603 = smd 1.1 x 1: 1 -0.85,0; 2 0.85,0
WCAP-CSGP_1206 = smd 0.9 x 1.6: 1 -1.55,0; 2 1.55,0
PANASONIC_D = smd 3 x 1.4: + 2.4,0; - -2.4,0
POWERDI123 = smd 0.9 x 1.4: 1 1.6,0 | smd 2.2 x 1.4: 2 -0.95,0
SOD-323F = smd 1 x 0.8: A -1,0; C 1,0
SOD523 = smd 0.7 x 0.5: A 0.7,0; C -0.6,0
SOP65P490X110-9N = smd 1.425 x 0.45: 1 -2.212,0.975; 2 -2.212,0.325; 3 -2.212,-0.325; 4 -2.212,-0.975; 5 2.212,-0.975; 6 2.212,-0.325; 7 2.212,0.325; 8 2.212,0.975 | smd 1.68 x 1.88: 9 0,0
SOIC127P600X175-8N = smd 1.981 x 0.533: 1 -2.464,1.905; 2 -2.464,0.635; 3 -2.464,-0.635; 4 -2.464,-1.905; 5 2.464,-1.905; 6 2.464,-0.635; 7 2.464,0.635; 8 2.464,1.905
1X05 = drill 1.016 pad 1.88: 1 0,0; 2 2.54,0; 3 5.08,0; 4 7.62,0; 5 10.16,0
1X03 = drill 1.016 pad 1.88: 1 0,0; 2 2.54,0; 3 5.08,0
2X3-NS = drill 1.016 pad 1.88: 1 -2.54,-1.27; 2 -2.54,1.27; 3 0,-1.27; 4 0,1.27; 5 2.54,-1.27; 6 2.54,1.27
1X14-CB = drill 1.016 pad 1.778: 1 -16.51,0; 2 -13.97,0; 3 -11.43,0; 4 -8.89,0; 5 -6.35,0; 6 -3.81,0; 7 -1.27,0; 8 1.27,0; 9 3.81,0; 10 6.35,0; 11 8.89,0; 12 11.43,0; 13 13.97,0; 14 16.51,0
WE-DD_7332/734512 = smd 0.8 x 2.2: 1 0.8,-2.35; 2 0.8,2.35; 3 -0.8,2.35; 4 -0.8,-2.35
INDP125125X600N = smd 2.9 x 5.4: 1 -4.85,0; 2 4.85,0
TRIMPOT-SMD-3MM-CLOSED = smd 1 x 0.9: 1 -0.85,-1.65; 3 0.85,-1.65 | smd 1.1 x 0.9: 2 0,1.65
SOT65P210X110-6N = smd 1.2 x 0.4: 1 -0.95,0.65; 2 -0.95,0; 3 -0.95,-0.65; 4 0.95,-0.65; 5 0.95,0; 6 0.95,0.65
R0603 = smd 1 x 1.1: 1 -0.85,0; 2 0.85,0
SOP65P640X120-14N = smd 1.475 x 0.45: 1 -2.938,1.95; 2 -2.938,1.3; 3 -2.938,0.65; 4 -2.938,0; 5 -2.938,-0.65; 6 -2.938,-1.3; 7 -2.938,-1.95; 8 2.938,-1.95; 9 2.938,-1.3; 10 2.938,-0.65; 11 2.938,0; 12 2.938,0.65; 13 2.938,1.3; 14 2.938,1.95
DPAK = smd 1.6 x 3: 1 -2.28,-5.31; 3 2.28,-5.31 | smd 4.826 x 5.715: 4 0,1.588
M1206 = smd 1.6 x 2: 1 -1.4,0; 2 1.4,0
TEENSY4.0 = drill 0.8: 3.3V@1 7.62,10.16; 3.3V@2 -2.54,-17.78; AGND 7.62,12.7; D0 -7.62,12.7; D1 -7.62,10.16; D2 -7.62,7.62; D3 -7.62,5.08; D4 -7.62,2.54; D5 -7.62,0; D6 -7.62,-2.54; D7 -7.62,-5.08; D8 -7.62,-7.62; D9 -7.62,-10.16; D10 -7.62,-12.7; D11 -7.62,-15.24; D12 -7.62,-17.78; D13/LED 7.62,-17.78; D14/A0 7.62,-15.24; D15/A1 7.62,-12.7; D16/A2 7.62,-10.16; D17/A3 7.62,-7.62; D18/A4 7.62,-5.08; D19/A5 7.62,-2.54; D20/A6 7.62,0; D21/A7 7.62,2.54; D22/A8 7.62,5.08; D23/A9 7.62,7.62; GND@1 -7.62,15.24; GND@2 0,-17.78; ON/OFF 5.08,-17.78; PROGRAM 2.54,-17.78; VBAT -5.08,-17.78; VIN 7.62,15.24; VUSB 5.08,12.7

### Placement (x,y rotation side)
1.65V_IC  84.7,51.35 270 top
3.3V_LDO  143.03,26.11 90 top
5V_BUCK  156.89,42.13 270 top
AGC_IC  94.98,24.58 90 top
B2B_MCU  141.3,57.8 0 top
B2B_MCU1  154.4,16.5 180 top
B2B_RX  98.9,57.4 180 top
B2B_RX1  85.9,15.4 0 top
B2B_RX2  98.9,54.9 270 top
B2B_TX  36,50 180 top
B2B_TX1  36,9 180 top
B2B_TX2  36,47.5 270 top
BATTERY  159.89,45.38 270 top
BOOST_IC  18.8,17.57 0 top
BOOST_VIN  3.6,23 0 top
BP_IC  94.76,35.51 0 top
C1_3.3V  149.73,28.41 180 top
C1_5V  150.17,38.37 270 top
C1_AGC  93.61,21.53 0 top
C1_BOOST  10,23.2 180 top
C1_DAMP  25.9,47.49 180 top
C1_SW  23.92,23.74 270 top
C1A  90.32,38.72 0 top
C1B  87.35,32.02 0 top
C1C  101.02,33.08 180 top
C1D  104.06,40.18 180 top
C2_3.3V  149.73,26.13 180 top
C2_5V  150.49,33.27 90 top
C2_AGC  90.42,23.79 270 top
C2_BOOST  10,27.4 180 top
C2_DAMP  18.68,48.29 90 top
C2_SW  10.64,20.42 180 top
C2A  87.33,38.74 0 top
C2B  87.31,33.2 0 top
C2C  104.08,33.76 180 top
C2D  104.07,39.05 180 top
C3_BATTERY  158.47,55.6 180 top
C3_BOOST  10,25.2 180 top
C4_BATTERY  164,47.75 270 top
C5_BATTERY  155.23,55.6 180 top
C6_BATTERY  160.56,51.67 0 top
C_INTV  14.18,17.07 0 top
C_SS  22.76,18.48 180 top
C_VC  14.98,13.93 90 top
C_VIN  14.12,18.61 0 top
CAP1_DAMP  32.23,45.51 0 top
CAP2_DAMP  21.68,45.51 0 top
CAP_1.65V  85.46,48.58 180 top
CAP_AGC  91.86,24.44 90 top
CAP_BP  94.85,38.53 0 top
CAP_INST  90.9,48.04 180 top
CAP_POT1  75.83,41.28 180 top
CAP_POT2  28.05,12.15 180 top
D1_BOOST  12.57,24.52 90 top
D1_DRV1  30.68,47.55 180 top
D1_RX+  95.24,52.7 90 top
D1_RX-  95.4,49.49 90 top
D1_TX+  49.66,35.14 180 top
D1_TX-  49.66,24.93 0 top
D2_DRV2  20.75,48.24 90 top
D2_RX+  96.7,52.8 270 top
D2_RX-  96.66,49.61 270 top
D2_TX+  49.54,36.37 0 top
D2_TX-  49.76,26.45 180 top
D5  36.6,55.4 0 top
D6  39.2,54.4 0 top
DRIVER1  27.08,44.68 180 top
DRIVER2  16.71,44.63 180 top
GND  33.7,56 0 top
GND1  56.2,31.6 0 top
GND2  4.5,20.1 0 top
INST_IC  90.96,51.42 180 top
J2  158.07,28.66 270 top
JP1_AGC  112.83,38.62 90 top
JP1_BOOST  19.3,4.8 150 top
JP1_DAMP  2.81,26.72 90 top
JP1_POT1  72.1,36.1 270 top
JP2_AGC  112.86,30.26 90 top
JP6  134.2,37.12 270 top
JP7  155.16,37.12 270 top
JP_AGC  110.67,27.3 270 top
L1_BOOST  18.13,23.8 90 top
L1_DAMP  41.11,36.02 180 top
L2_DAMP  41.29,22.03 0 top
PIEZO  50.39,30.75 90 bottom
PIEZO+  55.7,34.7 0 top
PIEZO-  56,28.3 0 top
PIEZO_TX+  54.8,37.9 0 top
PIEZO_TX-  55.7,25 0 top
PIN1_AGC  107.65,22.5 90 top
PIN1_BP  71.89,27.65 90 top
PIN1_DAMP  4.14,38.77 255 top
PIN1_INST  71.93,42.66 90 top
PIN1_POT2  41.44,5.45 35 top
PIN2_AGC  104.58,25.05 270 top
PIN2_POT2  50.08,12.72 225 top
POT1_AGC  87.73,25.12 0 top
POT1_IC  75.87,43.35 180 top
POT1_STAT  76.2,34.1 90 top
POT2_IC  30.16,17.77 90 top
Q1  29.05,31.87 270 top
Q2  26.81,39.19 90 top
Q3  16.19,31.89 270 top
Q4  14.45,39.03 90 top
R1_1.65V  81.74,49.06 90 top
R1_AGC  98.75,23.89 90 top
R1_DIODE  98.9,49.5 0 top
R1_POT1  79.56,41.85 180 top
R1_POT2  31.3,12.25 0 top
R1A  87.28,40.29 180 top
R1B  90.31,37.14 180 top
R1C  104.07,31.92 0 top
R1D  101.06,37.22 0 top
R2_1.65V  81.7,52.27 270 top
R2_AGC  110.17,37.43 90 top
R2_DIODE  98.9,47.28 180 top
R2_POT1  79.52,44.35 180 top
R2_POT2  35.5,12.21 0 top
R2A  87.3,37.07 180 top
R2B  87.48,34.8 180 top
R2C  104.11,35.34 0 top
R2D  104.08,37.23 0 top
R3_AGC  110.2,32.88 270 top
R3A  90.35,40.29 0 top
R3B  90.41,32.63 0 top
R3C  101.04,34.69 180 top
R3D  100.88,39.57 180 top
R_FB  19.58,13.37 180 top
R_RT  22.78,16.57 0 top
R_SEL  12.26,9.54 315 top
R_SENSE  7.67,31.1 90 top
R_VC  16.78,13.92 270 top
U$1  144.83,37.99 0 top

### Tracks (layer width: path | path; a pad name or v marks a point on that pad's centre or on a via)
1.65V  (via drill 0.35)
  Top 0.152: INST_IC.5 88.7,53.33 | 88.13,37.05 R2A.1 | 83.75,50.4 1.65V_IC.4 83.7,50.05 | 1.65V_IC.1 85.62,52.58 85.62,52.5 85.62,52.27 | 96.91,35.3 BP_IC.12 | 96.66,50.44 D2_RX-.C
  Top 0.254: 85.62,52.27 86.67,53.33 INST_IC.5 88.5,54.5 89,55 94.6,55 v95.2,54.4 95.24,54.36 D1_RX+.A 95.4,53.4 | 83.7,50.05 v83.7,48.9 | v98.6,36.6 98.27,36.27 BP_IC.14 96.91,36.23 96.15,36.23 95.92,36 95.92,35.8 | 95.92,35.8 95.92,35.53 96.15,35.3 96.91,35.3 | 95.4,53.4 D2_RX+.C | D1_RX-.A 95.4,50.5 v96,51.1 96.66,50.44 | R2A.1 88.1,37.02 v88.1,35.9 88.33,35.67 R2B.1 | 102.5,36.1 R2C.1 | v102.1,36.1 102.5,36.1 | R2D.1 103.23,36.83 102.5,36.1 | BP_IC.3 91.57,36.27 v91,35.7 91.44,35.26 BP_IC.5 92.62,35.3 93.54,35.3 94.04,35.8 95.92,35.8 | 95.4,53.48 95.4,53.4 | 1.65V_IC.4 83.75,50.95 84.3,51.5 85.3,51.5 85.62,51.83 85.62,52.5
  Bottom 0.254: v83.7,48.9 83.7,44.9 87.7,40.9 87.7,36.3 v88.1,35.9 90.8,35.9 v91,35.7 | v95.2,54.4 95.2,51.9 v96,51.1 | v98.6,36.6 101.6,36.6 v102.1,36.1
3.3V  (via drill 0.35)
  Top 0.152: 3.3V_LDO.2
  Top 0.813: 3.3V_LDO.2 147.76,26.13 v147.8,26.1 148.95,26.1 C2_3.3V.2
  Bottom 0.813: v147.8,26.1 147.8,21.49 148.58,20.71 148.58,18.3 B2B_MCU1.4
  pour Bottom: 132.7,26.5 161.8,26.5 161.9,26.4 161.9,15.8 160.4,14.3 158.3,12.2 146.4,12.2 138.9,12.2 133,18.1 133,26.2
3.3V_MCU  (2 unrouted)
  Top 0.152: U$1.3.3V@2
  Top 0.2: J2.4 158.1,21.01 158.1,20.37 156.02,18.29 144.2,18.29 U$1.3.3V@2
  Top 0.254: U$1.3.3V@1 152.85,48.55 JP7.3 | J2.1 158.07,28.37 156.48,26.78 156.48,24.53 155.92,23.97 151.77,23.97 149.91,22.11 U$1.ON/OFF
5V  (via drill 0.35)
  Top 0.254: JP7.1 152.85,53.63 U$1.VIN
  Top 0.813: 3.3V_LDO.3 147.88,28.42 v147.9,28.4 v147.91,28.41 C1_3.3V.2 | v149.4,34 149.42,34.02 C2_5V.2
  pour Bottom: 148,61 148,55.7 147,54.7 145.1,52.8 145.1,27.5 145.2,27.4 161.8,27.4 161.9,27.5 161.9,57.6 159.3,60.2 157.6,61.9 147.9,61.9 148,61.8
A0
  Top 0.254: U$1.D14/A0 152.85,23.15 JP7.13
  Bottom 0.254: B2B_MCU.6 153.4,57.2 153.4,23.7 U$1.D14/A0
A1
  Top 0.254: U$1.D15/A1 152.85,25.69 JP7.12
  Bottom 0.254: B2B_MCU.5 151.46,26.28 U$1.D15/A1
A2
  Top 0.254: JP7.11 152.85,28.23 U$1.D16/A2
A3
  Top 0.254: JP7.10 152.85,30.77 U$1.D17/A3
A4
  Top 0.254: JP7.9 152.85,33.31 U$1.D18/A4
  Bottom 0.254: JP7.9 155.16,32.55 156.58,31.13 156.58,18.68 B2B_MCU1.1
A5
  Top 0.254: U$1.D19/A5 152.85,35.85 JP7.8
  Bottom 0.254: JP7.8 153.91,34.59 153.91,18.55 B2B_MCU1.2
A6
  Top 0.254: JP7.7 152.85,38.39 U$1.D20/A6
A7
  Top 0.254: JP7.6 152.85,40.93 U$1.D21/A7
A8
  Top 0.254: JP7.5 152.85,43.47 U$1.D22/A8
A9
  Top 0.254: JP7.4 152.85,46.01 U$1.D23/A9
AGC_OUT+  (via drill 0.35)
  Top 0.254: AGC_IC.11 94.73,27.13 v94.9,27.3
  Bottom 0.254: v94.9,27.3 94.9,27.35 96.16,28.61 106.21,28.61 111.68,34.07 113.57,34.07 114.4,34.9 114.4,40.29 113.53,41.16 JP1_AGC.2
AGC_OUT-  (via drill 0.35)
  Top 0.254: AGC_IC.10 95.23,26.62 v95.91,27.3
  Bottom 0.254: v95.91,27.3 96.51,27.9 107.36,27.9 112.26,32.8 JP2_AGC.2
AGC_VREF  (via drill 0.35)  (1 unrouted)
  Top 0.152: 88.93,23.47 88.7,23.47 POT1_AGC.3 88.78,23.27
  Top 0.254: AGC_IC.16 93.48,23.53 92.16,22.21 91.35,22.21 C2_AGC.2 90.29,23.27 88.78,23.27 | v88.6,22.3 88.6,23.37 88.7,23.47
  Bottom 0.254: v88.6,22.3 89.53,22.3 90.98,20.84 91.67,20.84 93.13,22.3 v96.9,22.3
AGND
  Top 0.254: JP7.2 152.85,51.09 U$1.AGND
BATTERY_VIN+  (via drill 0.35)
  Top 0.152: C1_5V.1 150.47,39.42 | C5_BATTERY.1 156.13,55.78
  Top 0.813: C6_BATTERY.+ 162.36,51.67 | C5_BATTERY.1 156.13,56.5 156.53,56.9 158.07,56.9 C3_BATTERY.1 162.96,52.01 C6_BATTERY.+ | C6_BATTERY.+ 164,50.63 v164,50.1 C4_BATTERY.1 | v148.8,39 148.92,39.12 C1_5V.1
  pour POWER: 123.4,47.4 137.8,61.8 158.9,61.8 173.1,47.6 173.1,47.1 173.1,27 172.8,26.7 158.3,12.2 137.8,12.2 123.3,26.7 123.3,47.4
BG1  (1 unrouted)
  Top 0.254: DRIVER1.4 28.48,45.66 28.25,45.42 28.25,43.28 29.09,42.44 29.09,39.94 Q2.1
BG2
  Top 0.152: DRIVER2.4 18.21,45.61
  Top 0.254: 18.21,45.61 17.83,45.23 17.83,38.68 Q4.1
BOOST_VIN  (via drill 0.35, 0.5)
  Top 0.152: 18.7,13.34 R_FB.2
  Top 0.254: v15.9,16.2 15.9,16.54 16.46,17.1 17.27,17.1 BOOST_IC.4
  Top 0.508: v18.7,11.7 18.7,13.34
  other vias: 13.4,20.4 12.6,27.4
  pour POWER: 25.4,28.6 26.5,27.5 26.5,-0.5 24.5,-2.5 12.5,3.5 10.8,5.2 6.1,10.8 -0.45,17.35 -0.45,27.7 5.03,27.7 5.25,28.6
  pour Top (no thermals): 10.4,28.1 13.4,28.1 13.4,25.5 11.7,25.5 11.5,25.3 11.5,21.9 11.9,21.5 14,21.5 14,19.4 11.6,19.4 10.4,20.6
BPA-
  Top 0.254: 87.98,38.77 C2A.2 88.24,39 88.5,39 89.5,40 R3A.1 | 89.82,39.97 R3A.1 | BP_IC.2 93.43,36.76 93.55,36.88 93.55,38.3 93.55,38.51 93.55,39.45 91.88,41.12 90.58,41.12 89.75,40.29 R3A.1
BPA_OUT
  Top 0.254: 92.53,37.26 BP_IC.1 91.28,37.26 R1B.1 90.97,37.33 C1A.2 91.2,38.95 R3A.2
BPB-
  Top 0.254: C2B.2 88.99,33.2 R3B.1 89.56,32.73 91.58,34.75 BP_IC.6
BPB_OUT
  Top 0.152: 92.64,34.33 BP_IC.7 | R1C.1 103.1,31.8
  Top 0.254: 103.1,31.8 96.66,31.8 94.19,34.27 BP_IC.7 92.56,34.28 91.83,34.28 91.25,33.69 91.25,32.64 R3B.2 90.38,31.75 88.27,31.75 C1B.2
BPC-
  Top 0.254: BP_IC.11 96.93,34.73 96.15,34.73 95.92,34.5 95.92,33.32 96.94,32.3 100.81,32.3 101,32.48 101,33.8 R3C.1 102.3,34.69 103.23,33.76 C2C.2
BPC_OUT
  Top 0.152: 100.37,34.51 R3C.2 100.39,34.89 | R1D.1 100.39,37.04
  Top 0.254: 100.37,34.51 C1C.2 99.19,34.27 BP_IC.10 | 100.39,37.04 100.39,34.89
BPD-
  Top 0.152: 101.46,39.57 R3D.1
  Top 0.254: BP_IC.15 97.75,36.76 99.2,38.2 100.36,38.2 R3D.1 102.33,39.57 102.9,39 103.37,39 C2D.2
BPD_OUT  (via drill 0.35)
  Top 0.152: PIN1_BP.1 72.01,27.53 72.41,27.53 | 96.94,38.16 v96.9,38.2 | C1_AGC.1 92.93,21.5 | 78.3,21.5 78.07,21.73
  Top 0.254: 78.07,21.73 72.41,27.53 | C1D.2 103.39,40.18 103.03,40.55 101.01,40.55 R3D.2 99.36,38.9 97.6,38.9 v96.9,38.2 | BP_IC.16 96.94,38.16 | 92.93,21.5 v91.4,21.5 78.3,21.5
  Bottom 0.254: v91.4,21.5 90.9,21.5 89.59,22.81 89.59,25.65 90.95,27.01 93.03,27.01 96.9,30.88 v96.9,38.2
D0
  Top 0.254: U$1.D0 136.81,51.09 JP6.2
D1
  Top 0.254: U$1.D1 136.81,48.55 JP6.3
D2
  Top 0.254: U$1.D2 136.81,46.01 JP6.4
D3
  Top 0.254: U$1.D3 136.81,43.47 JP6.5
D4
  Top 0.254: U$1.D4 136.81,40.93 JP6.6
D5
  Top 0.254: U$1.D5 136.81,38.39 JP6.7
  Bottom 0.254: U$1.D5 143.84,44.62 B2B_MCU.2
D6
  Top 0.254: JP6.8 137.6,35.85 | U$1.D6 137.6,35.85 | B2B_MCU.1 141.3,39.55 137.6,35.85
D7
  Top 0.254: U$1.D7 136.81,33.31 JP6.9
D8
  Top 0.254: U$1.D8 136.81,30.77 JP6.10
D9
  Top 0.254: U$1.D9 136.81,28.23 JP6.11
D10
  Top 0.254: U$1.D10 136.81,25.69 JP6.12
D11
  Top 0.254: U$1.D11 136.81,23.15 JP6.13
D12
  Top 0.254: U$1.D12 136.81,20.61 JP6.14
FBKM
  Top 0.254: AGC_IC.9 101.01,26.08 PIN2_AGC.2
FBKP
  Top 0.254: PIN2_AGC.1 101.62,28.01 94.55,28.01 94.19,27.65 94.19,26.12 AGC_IC.12
GND  (via drill 0.35)
  Top 0.152: 150.48,30.28 v150.5,30.3 | v150.2,36 150.17,36.03 | U$1.GND@2 144.92,20.21 | 158.07,23.5 J2.3 | 156.8,20.66
  Top 0.2: 144.92,20.21 146.44,18.69 155.89,18.69 156.8,19.6 156.8,20.66 156.8,22.23 158.07,23.5
  Top 0.254: JP6.1 136.81,53.63 U$1.GND@1 | C4_BATTERY.2 163.9,46.85
  Top 0.813: C2_3.3V.1 C1_3.3V.1 150.48,30.28 | C2_5V.1 v150.49,30.31 v150.5,30.3 | C1_5V.2 150.17,36.03 | 3.3V_LDO.1 146.7,23.33 v146.7,22.4 | B2B_MCU.3 148.58,55.6 C5_BATTERY.2 | C3_BATTERY.2 157.9,55.27 v157.9,53.2 157.9,51.93 C6_BATTERY.- | BATTERY.2 163.8,46.65 C4_BATTERY.2
  pour GND: 123.3,32.6 123.3,47.3 137.2,61.2 137.2,61.6 137.6,62 158.4,62 173.1,47.3 173.1,28.5 173.1,27.2 158.4,12.5 137.8,12.5 123.6,26.7 123.3,27
INMD
  Top 0.152: 95.25,23.06 AGC_IC.3
  Top 0.254: 95.25,23.06 95.25,22.59 96.59,21.24 105.26,21.24 106.15,22.13 106.15,23.54 PIN1_AGC.2
INPD
  Top 0.152: AGC_IC.2 94.75,23.06
  Top 0.254: PIN1_AGC.1 105.89,20.74 96.5,20.74 94.75,22.48 94.75,23.06
INST_OUT  (via drill 0.35)
  Top 0.152: v86.9,52 88.44,52 INST_IC.6
  Top 0.254: R1A.1 88.1,40.32 v88.1,42
  Bottom 0.254: v88.1,42 88.1,50.8 v86.9,52 84.5,49.6 78.87,49.6 PIN1_INST.1
INTV
  Top 0.152: C_INTV.2 15.15,17.39
  Top 0.254: C_INTV.2 15.33,17.57 BOOST_IC.3
LED
  Top 0.254: U$1.D13/LED 152.85,20.61 JP7.14
N$2
  Top 0.152: DRIVER1.6 | C1_DAMP.2 25.08,47.49
  Top 0.254: DRIVER1.6 24.16,45 23.79,45.37 23.79,47.09 24.19,47.49 C1_DAMP.2 | 25.08,47.49 25.91,48.32 28.91,48.32 D1_DRV1.C
N$3
  Top 0.152: DRIVER2.6 | 18.62,49.2 C2_DAMP.2 18.78,49.24
  Top 0.254: DRIVER2.6 13.79,44.95 13.46,45.28 13.46,46 16.66,49.2 18.62,49.2 | 18.78,49.24 D2_DRV2.C
N$4
  Top 0.254: JP1_POT1.6 74.76,34.95 POT1_STAT.2
N$7
  Top 0.152: 86.45,38.51 C2A.1 86.68,38.9 86.65,38.87 | R1A.2 86.65,40.07
  Top 0.254: C2A.1 87.47,37.95 88.7,37.95 89.47,38.72 C1A.1 | 86.65,40.07 86.65,38.87 86.65,37.27 R2A.2
N$8
  Top 0.152: 86.63,33.28 86.65,33.26 C2B.1 | C2B.1 86.7,33.16 | C1B.1 | C2B.1 86.6,33.26 | R2B.2 86.63,34.78
  Top 0.254: C1B.1 86.7,33.16 | 86.63,33.28 R2B.2 | 86.63,34.78 87.44,33.97 89.12,33.97 89.56,34.41 89.56,37.04 R1B.2
N$9
  Top 0.152: R2C.2 104.76,35.14 | 104.76,33.79 C2C.1 | 104.73,32.11 R1C.2
  Top 0.254: 104.76,35.14 104.76,33.79 | C2C.1 104.73,32.98 | 104.73,32.98 104.73,32.11 | 104.73,32.98 101.77,32.98 C1C.1
N$10
  Top 0.152: C2D.1 | 104.72,37.44 R2D.2 104.93,37.3
  Top 0.254: C1D.1 C2D.1 | C2D.1 104.72,37.44 | 104.93,37.3 104.03,38.21 102.4,38.21 101.91,37.72 R1D.2
N$11
  Top 0.152: C_VC.2 15.27,14.58
  Top 0.254: 15.27,14.58 R_VC.2
N$12
  Top 0.152: R1_AGC.2 98.34,24.33
  Top 0.254: AGC_IC.6 96.51,24.3 96.9,24.3 97.33,24.74 R1_AGC.2
N$13
  Top 0.152: R2_1.65V.2 81.74,51.38
  Top 0.254: 81.74,51.38 R1_1.65V.2 | R2_1.65V.2 82.57,51.42 1.65V_IC.3
N$14
  Top 0.152: AGC_IC.1 94.26,23.05
  Top 0.254: 94.26,23.05 C1_AGC.2
N$15
  Top 0.254: JP1_POT1.5 71.42,33.56 72.79,32.19 73.85,32.19 74.91,33.25 POT1_STAT.1
N$17
  Top 0.152: 110.21,38.32 R2_AGC.2 110.51,38.62
  Top 0.254: 110.51,38.62 JP1_AGC.1
N$18
  Top 0.152: JP2_AGC.1
  Top 0.254: R3_AGC.2 111.09,32.03 JP2_AGC.1
N$19  (via drill 0.35)
  Top 0.152: 90.42,25.38 v90.4,25.4 | 93.46,24.85 AGC_IC.14
  Top 0.254: C2_AGC.1 90.42,25.38 | v90.4,25.4 90.4,26 91.17,26.77 92.33,26.77 92.75,26.35 92.75,25.09 92.98,24.85 93.46,24.85
  Bottom 0.254: v90.4,25.4 98.9,25.4 100.4,26.9 110.27,26.9 JP_AGC.1
N$20
  Top 0.254: POT1_AGC.2 88.42,27.46 92.55,27.46 93.48,26.53 AGC_IC.13
N$21  (via drill 0.5)
  Top 0.152: R_SENSE.2 7.8,32.63
  Top 0.254: 7.8,32.63 v7.8,35.2 | R_SENSE.2 7.67,31.47 7.5,31.3 6.4,31.3 4.74,32.96 4.74,36.84 4.14,37.43 PIN1_DAMP.1 | v19.7,39.7 19.7,41.25 Q4.3
  Bottom 0.254: v7.8,35.2 12.3,39.7 v19.7,39.7
N$22
  pour Top (no thermals): 11.8,24.8 14.3,24.8 14.7,25.2 17,25.2 17,24 14.2,24 13.4,23.2 13.4,22.4 11.8,22.4
N$23
  Top 0.61: JP1_BOOST.3 14.46,7.34 R_SEL.2
O1  (via drill 0.5)
  Top 0.152: 28.21,22.39 v28.1,22.5
  Top 0.254: POT2_IC.14 28.21,22.39
  Bottom 0.254: PIN2_POT2.2 38.19,21.01 29.62,21.01 28.14,22.5 v28.1,22.5
O2  (via drill 0.5)
  Top 0.152: POT2_IC.12 29.5,20.72
  Top 0.254: 29.5,20.72 v29.5,22.5
  Bottom 0.254: v29.5,22.5 29.5,22.47 30.45,21.52 41.28,21.52 PIN2_POT2.1
PIEZO+  (1 unrouted)
  Top 0.152: 50.24,35.16 D1_TX+.C 50.39,35.01
  Top 0.254: D2_TX+.A 50.24,35.16 | B2B_RX2.1 98.9,54.08 97.68,52.86 97.68,51.57 R1_DIODE.2
  Top 0.61: 50.39,35.01 PIEZO.1 | PIEZO+.TP 50.7,34.7 D1_TX+.C
  Bottom 1.016: B2B_TX2.1 50.39,33.01 PIEZO.1
PIEZO-  (1 unrouted)
  Top 0.254: D2_TX-.C D1_TX-.A | R2_DIODE.1 99.75,48.05 100.53,48.83 100.53,50.73 B2B_RX2.2
  Top 0.61: PIEZO.2 50.36,29.45 D2_TX-.C 52.21,28.3 PIEZO-.TP
  Bottom 1.016: PIEZO.2 49.02,29.48 35.9,42.6 B2B_TX2.2
PIEZO_RX+
  Top 0.152: INST_IC.3 93.47,52.1 | D1_RX+.C 95.19,52.05
  Top 0.254: D1_RX+.C D2_RX+.A 96.7,51.7 98.05,50.35 R1_DIODE.1 | 95.19,52.05 INST_IC.3
PIEZO_RX-
  Top 0.152: 94,50.78 INST_IC.2 94.11,50.78 | D2_RX-.A 96.64,48.89
  Top 0.254: 96.64,48.89 D1_RX-.C 94.7,49.59 94.7,50.2 94.11,50.78 | D2_RX-.A 98.05,47.52 R2_DIODE.2
PIEZO_TX+
  Top 0.152: D2_TX+.C 48.89,36.32 | 48.94,35.16 D1_TX+.A
  Top 0.254: D2_TX+.C 48.94,35.16
  Top 0.61: 48.89,36.32 46.26,36.32 L1_DAMP.1 | D2_TX+.C 50.47,37.9 PIEZO_TX+.TP
PIEZO_TX-
  Top 0.152: 46.16,22.03 L2_DAMP.2 | D1_TX-.C 49.06,24.91
  Top 0.254: D2_TX-.A D1_TX-.C
  Top 0.61: D1_TX-.C 46.16,22.03 | 49.06,24.91 50.52,23.45 54.15,23.45 PIEZO_TX-.TP
POT1_B
  Top 0.152: JP1_POT1.2 73.57,38.84 | 74.52,42.7 POT1_IC.6
  Top 0.254: 73.57,38.84 73.57,41.75 74.52,42.7
POT1_W
  Top 0.152: 74.9,43.35 POT1_IC.5
  Top 0.254: JP1_POT1.1 73.06,40.88 73.06,42.17 74.25,43.35 POT1_IC.5
POT_A1  (via drill 0.5)
  Top 0.254: v26.6,15.3 27.74,15.3 POT2_IC.1
  Bottom 0.254: v26.6,15.3 38.76,15.3 PIN1_POT2.3
POT_BOOST  (via drill 0.5)
  Top 0.152: POT2_IC.2
  Top 0.254: POT2_IC.2 28.87,13.9 28.73,13.76 27.69,13.76 27.26,14.2 v26.6,14.2
  Bottom 0.254: PIN1_POT2.2 36.27,14.2 v26.6,14.2 26.6,12.1 24.57,10.07 24.57,8.22 21.18,4.83 19.63,4.83 19.6,4.8 JP1_BOOST.1
POT_SEL
  Top 0.152: R_FB.1 20.4,13.4
  Top 0.254: BOOST_IC.6 20.4,16.47 20.4,13.4
  Top 0.61: R_FB.1 20.43,9.4 JP1_BOOST.2
PROGRAM
  Top 0.152: 158.07,25.54 J2.2
  Top 0.2: U$1.PROGRAM 148.44,19.14 148.48,19.1 148.53,19.05 155.61,19.05 156.38,19.81 156.38,23.84 158.07,25.54
RG2_INST
  Top 0.152: 93.62,49.31 INST_IC.1
  Top 0.254: JP1_POT1.4 73.73,36.46 78.66,36.46 88.9,46.7 92.8,46.7 93.62,47.52 93.62,49.31
RG_INST
  Top 0.152: 88.08,49.52 88.4,49.52 INST_IC.8
  Top 0.254: JP1_POT1.3 71.42,36.1 72.69,37.37 78.47,37.37 88.4,47.3 88.4,49.52
RT
  Top 0.254: BOOST_IC.7 21.43,17.07 R_RT.1
RX_3.3V  (via drill 0.35)
  Top 0.152: POT1_IC.1 76.6,42.7 | 84.81,49.99 1.65V_IC.5 | v89.1,48 89.14,48.04 | 81.7,48.17 R1_1.65V.1 | v80.4,43.1 v80.41,43.09 | 80.4,44.32 R2_POT1.1 | 75.16,41.3 CAP_POT1.2 | 91.8,23.73 CAP_AGC.1
  Top 0.254: 1.65V_IC.5 1.65V_IC.6 | CAP_AGC.1 92.4,24.33 AGC_IC.15 | BP_IC.4 92.64,35.7 93.37,35.7 94.2,36.53 CAP_BP.1 v94.2,39.8 | 76.6,42.7 CAP_POT1.2 | 84.81,49.99 CAP_1.65V.2 85.4,47.99 v85.4,47.4 | 89.14,48.04 CAP_INST.2 90.25,50.45 89.91,50.78 INST_IC.7 | v81.7,47.1 81.7,48.17 | v80.41,43.09 R1_POT1.1 | v80.4,43.1 80.4,44.32 | v74.3,41.3 75.16,41.3 | v91.8,22.9 91.8,23.73
  pour POWER: 67.3,43.2 67.3,47.3 78.7,58.7 81,61 103.4,61 116.5,47.9 116.5,30.1 116.5,26 103.8,13.3 102.1,11.6 84.7,11.6 81.6,11.6 69,24.2 67.3,25.9
  pour POWER: 67.3,43.2 67.3,47.3 78.7,58.7 81,61 103.4,61 116.5,47.9 116.5,30.1 116.5,26 103.8,13.3 102.1,11.6 84.7,11.6 81.6,11.6 69,24.2 67.3,25.9
RX_A0
  Bottom 0.254: B2B_RX.5 102.44,43.7 JP1_AGC.3
RX_A1
  Bottom 0.254: B2B_RX.6 107.1,36.5 111.7,36.5 JP2_AGC.3
RX_A4  (1 unrouted)
  Top 0.152: POT1_IC.4 75.3,44 | 78.49,44.53 R2_POT1.2 78.69,44.33
  Top 0.254: 75.3,44 75.83,44.53 78.49,44.53
RX_A5  (1 unrouted)
  Top 0.152: POT1_IC.3 76.84,43.98
  Top 0.254: 76.84,43.98 77.52,43.98 78.71,42.78 R1_POT1.2
RX_GND  (via drill 0.35)
  Top 0.152: 110.2,35.1 v110.2,35.2 | INST_IC.4 93.42,54.28 v93.4,54.3 | 77.48,41.28 v77.5,41.3 | POT1_IC.2 76.84,43.33 | CAP_AGC.2 91.8,25.15 | 86.8,23.39 POT1_AGC.1 | 92.86,48.04 v92.9,48
  Top 0.254: R3_AGC.1 110.2,35.1 110.2,36.55 R2_AGC.1 | v84.7,54.2 1.65V_IC.2 | R2_1.65V.1 v81.7,54.3 | v86.7,47.4 86.11,47.99 CAP_1.65V.1 | CAP_POT1.1 77.48,41.28 | 91.8,25.15 v91.8,26.1 | v86.8,22.3 86.8,23.39 | v98.6,35.4 98.24,35.76 BP_IC.13 | CAP_INST.1 92.86,48.04 | POT1_IC.2 77.54,43.35 77.7,43.19 77.7,41.5 v77.5,41.3 | v100.4,23.1 98.81,23.1 R1_AGC.1 97.96,23.83 AGC_IC.5 95.73,23.83 AGC_IC.17 95.78,24.58 96.01,24.81 96.46,24.81 AGC_IC.7 AGC_IC.8 | v95.5,39.8 CAP_BP.2
  pour GND: 67.2,47.1 81,60.9 81.4,60.9 103.4,60.9 103.7,60.6 116.4,47.9 116.6,47.9 116.6,26.2 116.5,26.1 102,11.6 101.9,11.5 81.9,11.5 67.7,25.7 67.3,25.7 67.3,47
SS
  Top 0.152: 20.3,17.47 BOOST_IC.8 20.32,17.59
  Top 0.254: 20.32,17.59 20.89,17.59 21.78,18.48 C_SS.2
SW
  Top 0.152: L1_BOOST.4 20.28,22.8
  pour Top (no thermals): 19.3,23.5 19.3,19.6 19.8,19.1 19.9,19 19.9,18.4 20.7,18.4 20.7,18.7 23.1,21.1 23.1,21.6 24.9,21.6 24.9,23.5
TG1
  Top 0.152: 24.96,44.26 DRIVER1.7 25.48,44.36 | 23.7,34.42 23.7,33.4 23.74,33.44 23.74,34.1 Q1.1
  Top 0.254: 23.74,34.1 22.04,35.8 22.04,42.14 22.9,43 22.9,43.8 23.46,44.36 DRIVER1.7
TG2
  Top 0.254: Q3.1 10.88,35.02 9.48,36.42 9.48,41.54 12.24,44.3 DRIVER2.7
TS1
  Top 0.152: Q2.4 25.22,37.7 24.42,38.5 23.9,39.02 | 35.65,36.02 L1_DAMP.2 36.26,35.18 | 24.3,43.7 DRIVER1.8
  Top 0.254: 24.42,38.5 24.42,36.39 25.67,35.14 25.67,31.52 Q1.3 | 24.3,43.7 23.9,43.3 23.9,39.02 | DRIVER1.8 25.68,43.7 25.91,43.94 25.91,46.01 26.75,46.85 C1_DAMP.1
  Top 1.016: Q2.4 29.23,35.18 36.26,35.18
TS2
  Top 0.152: 35.46,23.85 35.5,23.9 36.9,22.5 L2_DAMP.1 | DRIVER2.8 14.3,43.45 | 14.3,40.47 Q4.4 | 18.32,47.8 C2_DAMP.1
  Top 0.254: Q4.4 12.86,36.01 13.81,35.06 13.81,32.54 Q3.3 | DRIVER2.8 15.3,43.65 15.5,43.85 15.5,47.3 16,47.8 18.32,47.8 | 14.3,43.45 14.3,40.47
  Top 1.016: Q3.3 13.56,29.61 15.71,27.46 31.94,27.46 35.5,23.9
TX_3.3V
  Top 0.254: POT2_IC.4 30.78,14.83 30.81,14.8 | R1_POT2.1 30.45,13.35 30.81,13.71 30.81,14.8 | 30.81,14.8 POT2_IC.5
  Top 0.508: R2_POT2.1 34.43,12.21 33.51,11.29 31.41,11.29 R1_POT2.1 30.35,12.15 CAP_POT2.1 28.7,9.32 B2B_TX1.4
TX_5V
  Top 0.152: DRIVER2.3 | DRIVER1.3 | D1_DRV1.A 31.55,47.42 | 20.83,46.98 D2_DRV2.A | 28.89,50.09 28.39,50.09 28.37,50.09 B2B_TX.4
  Top 0.254: DRIVER2.3 19.73,44.95 20.29,45.51 CAP2_DAMP.1 20.83,46.98 | DRIVER1.3 30.1,45 30.61,45.51 CAP1_DAMP.1 | D2_DRV2.A 22.24,48.73 27.03,48.73 28.39,50.09
  Top 0.508: D1_DRV1.A 31.68,45.81 CAP1_DAMP.1 | 28.89,50.09 31.55,47.42
TX_A4
  Top 0.254: POT2_IC.7 33.73,14.83 R2_POT2.2 36,11.86 B2B_TX1.1
TX_A5  (via drill 0.5)
  Top 0.254: POT2_IC.6 31.46,14.1 32.15,13.41 R1_POT2.2 32.2,12.3 v33.3,12.3
  Bottom 0.254: v33.3,12.3 33.3,9.16 B2B_TX1.2
TX_BATTERY_VIN+  (via drill 0.5)
  Top 0.152: BOOST_IC.2 17.2,18.07 | 17.26,18.61 BOOST_IC.1 17.27,18.6 | v15.99,18.61 v16,18.6
  Bottom 1.016: JP1_DAMP.3 5.72,28.9 5.72,26.32 13.44,18.6 v16,18.6 17.52,17.08 19.35,17.08 23.3,13.13 B2B_TX1.6
  pour Top (no thermals): 17.2,23.6 17.7,23.1 17.7,17.9 14.3,17.9 14.3,23.6
TX_D5  (via drill 0.5)  (1 unrouted)
  Top 0.254: DRIVER2.2 20.3,44.3 v20.6,44 | DRIVER1.1 30.33,43.7 30.92,43.12 31.42,43.12 v32.3,44
  Top 0.508: D5.TP 36.6,53.14 B2B_TX.2
  Bottom 0.152: v20.6,44 20.6,44.06
  Bottom 0.254: 20.6,44.06 21.52,44.98 31.48,44.98 32.3,44.16 v32.3,44 33.88,45.58 33.88,49.58 B2B_TX.2
TX_D6  (via drill 0.5)  (1 unrouted)
  Top 0.254: DRIVER1.2 30.84,44.36 v31.2,44 | DRIVER2.1 19.78,43.66 20.22,43.22 21.02,43.22 v21.8,44
  Top 0.508: D6.TP 39.2,53.2 B2B_TX.1
  Bottom 0.152: 31.34,44 v31.2,44
  Bottom 0.254: v21.8,44 v31.2,44 32.1,43.1 32.6,43.1 34.3,44.8 34.3,48.3 B2B_TX.1
TX_GND  (via drill 0.5)  (18 unrouted)
  Top 0.152: L1_BOOST.1 | C1_SW.1 24.11,25.1 | C1_BOOST.2 | 13.27,18.61 C_VIN.1 | 13.47,17.13 C_INTV.1 13.6,17 | v23.4,20 v23.41,19.99 | C_SS.1 23.63,18.26 | 27.4,11.93 CAP_POT2.2 27.4,12.11 | POT2_IC.8 32.1,20.72 | 14.98,13.46 C_VC.1 | 22.53,47.27 v22.5,47.3 | CAP1_DAMP.2 33,45.59 | R_SEL.1 | BOOST_IC.9 20.28,18.05 | 19.13,17.57 BOOST_IC.11 | DRIVER2.9 | DRIVER1.9 27.08,45.58 | 32,41.35 Q2.3
  Top 0.254: POT2_IC.11 POT2_IC.10 POT2_IC.9 POT2_IC.8 | v32.1,22.6 32.1,20.72 | 20.28,18.05 19.61,18.05 19.13,17.57 | v32,39.9 32,41.35 | R_SENSE.1 7.67,30.73 7.6,30.8 6.2,30.8 3.48,33.52 PIN1_DAMP.2 | CAP_POT2.2 28.34,13.1 29,13.1 29.51,13.61 POT2_IC.3
  Top 0.508: CAP2_DAMP.2 22.53,47.27 | v33,47.6 33,45.59 | DRIVER2.9 v16.7,47 | 27.08,45.58 v28.3,46.8 | B2B_TX1.5 27.4,10.56 CAP_POT2.2 | v18.8,15.1 BOOST_IC.11 | v12.1,17.1 13.5,17.1 C_INTV.1
  Top 0.61: L1_BOOST.1 23.22,24.59 C1_SW.1 | v25.7,25.1 24.11,25.1 | C2_BOOST.2 v7.6,27.4 | C2_BOOST.2 C3_BOOST.2 C1_BOOST.2 | C1_BOOST.2 C2_SW.2 | C_VIN.1 13.47,17.13 | v23.41,19.99 C_SS.1 | 23.63,18.26 R_RT.2 | R_SENSE.1 7.67,28.83 C2_BOOST.2 | R_SEL.1 v10.3,11.5 | C_INTV.1 13.53,14.33 14.58,13.28 C_VC.1
  pour GND: -0.6,42.8 -0.6,17.2 17.6,-1 42.3,-1 59.6,16.3 59.6,42.7 42.6,59.7 16.3,59.7
VBAT
  Top 0.2: U$1.VBAT 142.06,17.9 157.47,17.9
  Top 0.254: 157.47,17.9 J2.5
VC
  Top 0.152: 17.02,15.01 R_VC.1
  Top 0.254: R_VC.1 16.78,16.05 BOOST_IC.5
VIN_DAMP  (via drill 0.5)
  Top 0.152: Q3.4 17.89,32 | v34.3,31.9 34.27,31.87
  Top 1.016: 17.89,32 v21.7,32 | Q1.4 34.27,31.87
  pour POWER: 4.32,28.12 5.2,29 39.6,29 39.63,42.9 2.81,42.9 -0.4,39.69 -0.4,28.12